# Altium project Copy of MB1019.PrjPCB (part 1 of 2)
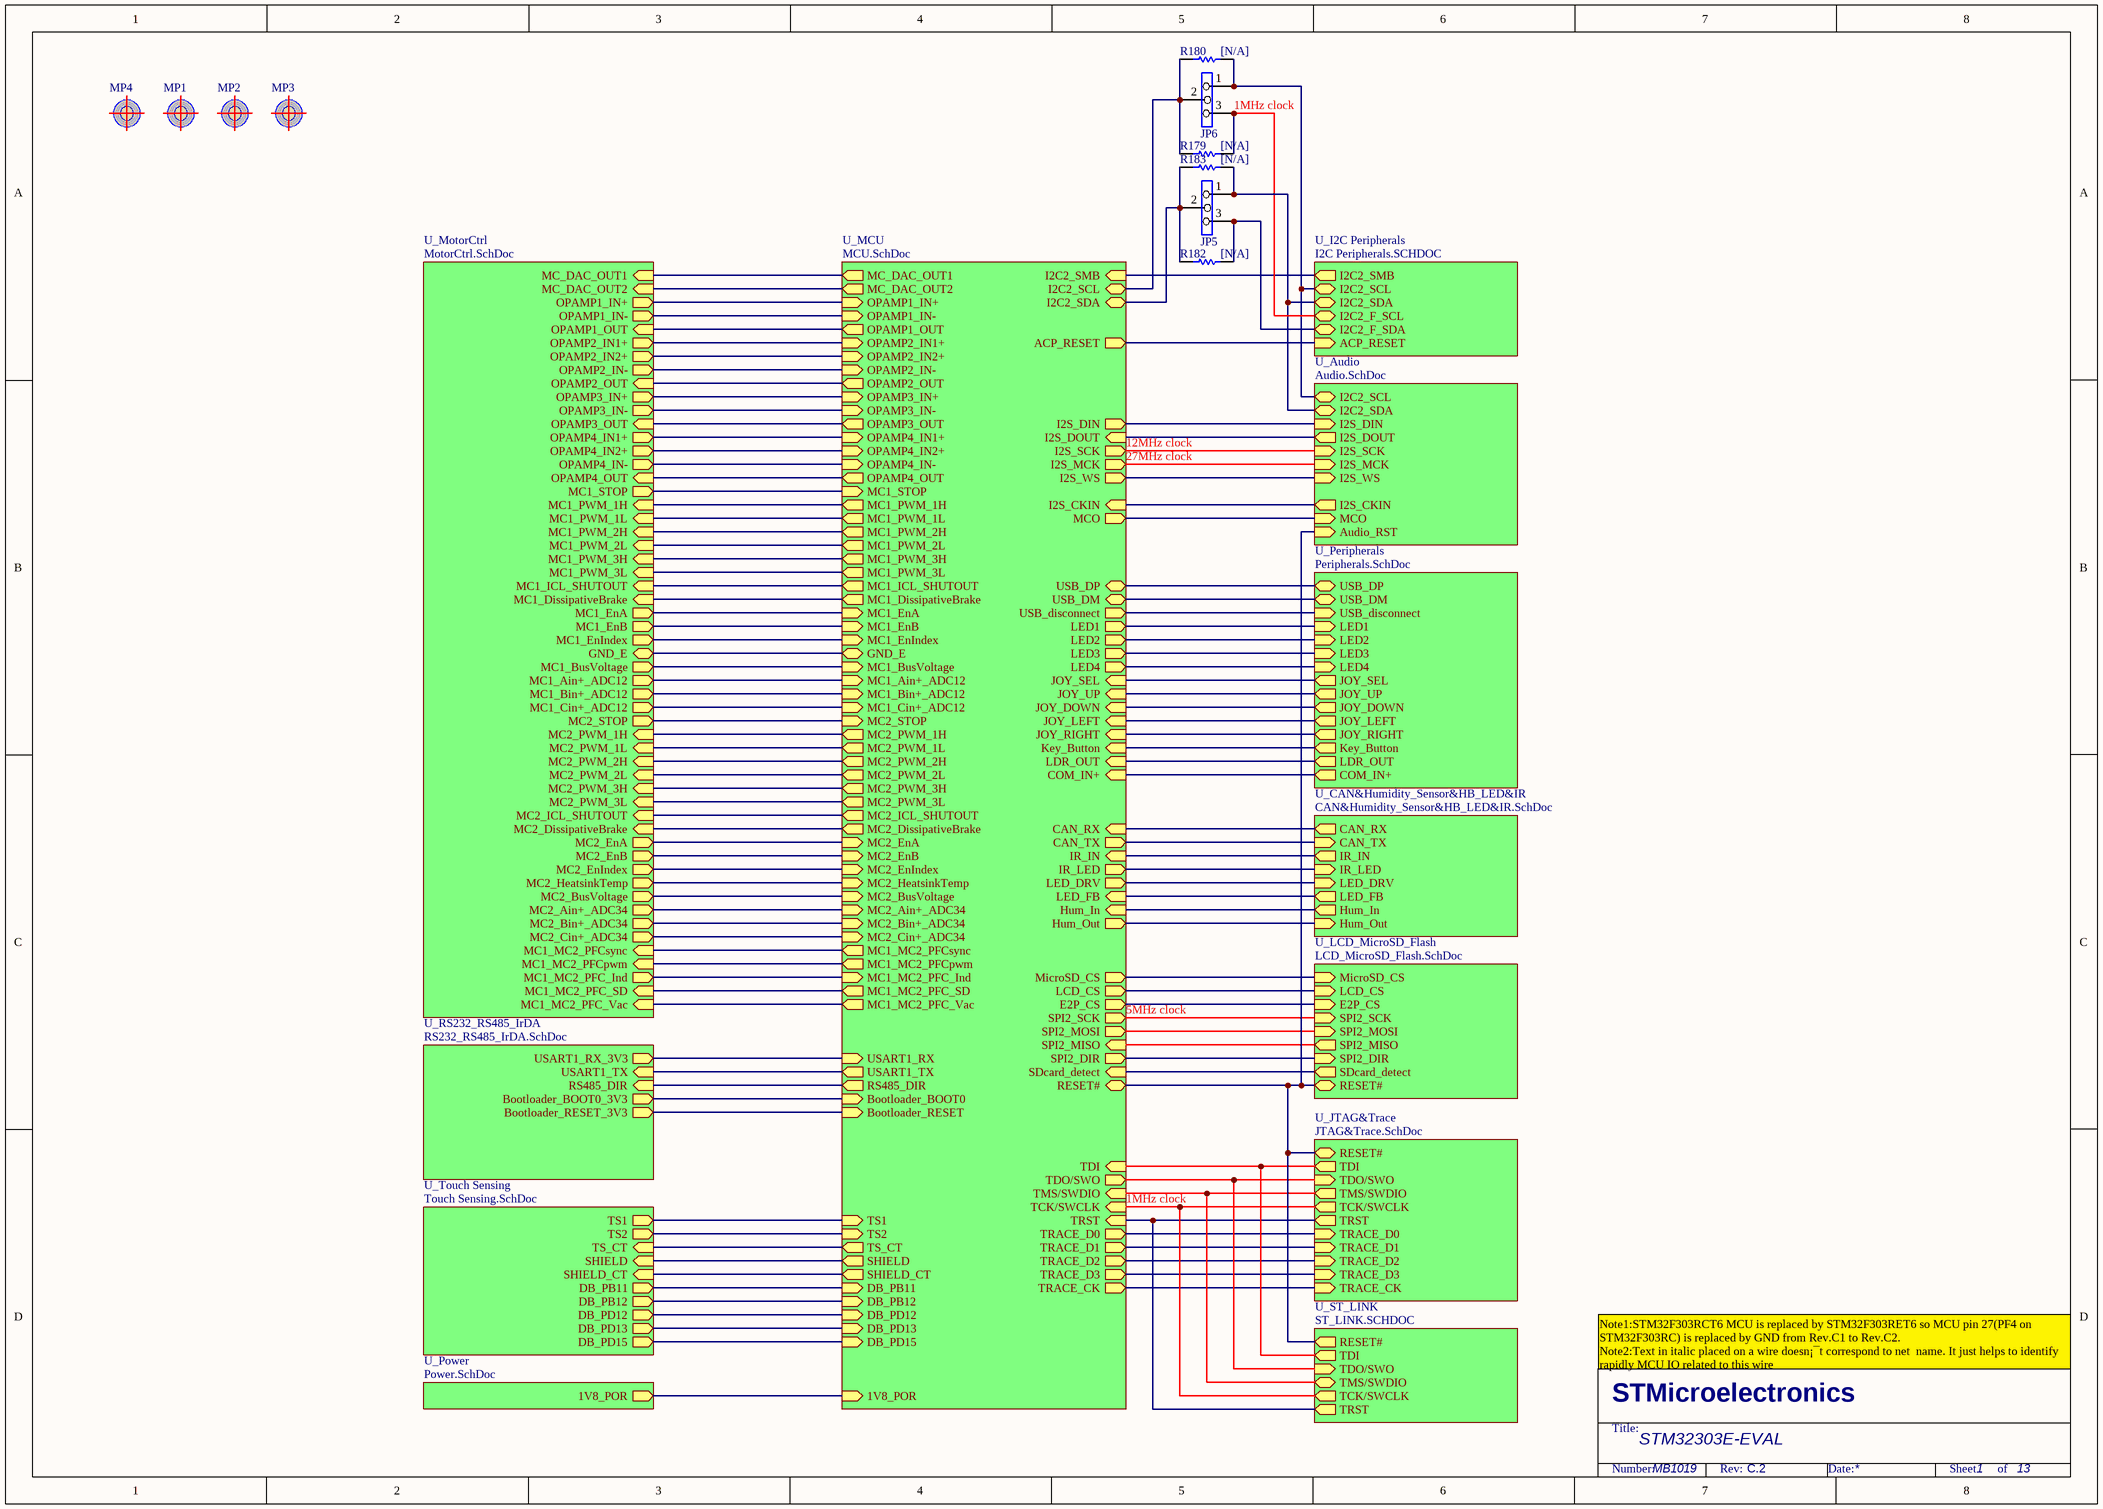
[diagram p0: MB1019.SchDoc]
13 sheets, 557 parts. Net scope: hierarchical (ports join the sheet entries above them; power ports are global).
Board file: MB1019.PcbDoc
Sheets:
  MB1019.SchDoc
    U_MCU = MCU.SchDoc
    U_MotorCtrl = MotorCtrl.SchDoc
    U_RS232_RS485_IrDA = RS232_RS485_IrDA.SchDoc
    U_Touch Sensing = Touch Sensing.SchDoc
    U_Peripherals = Peripherals.SchDoc
    U_CAN&Humidity_Sensor&HB_LED&IR = CAN&Humidity_Sensor&HB_LED&IR.SchDoc
    U_JTAG&Trace = JTAG&Trace.SchDoc
    U_ST_LINK = ST_LINK.SCHDOC
    U_Power = Power.SchDoc
    U_Audio = Audio.SchDoc
    U_I2C Peripherals = I2C Peripherals.SCHDOC
    U_LCD_MicroSD_Flash = LCD_MicroSD_Flash.SchDoc

## Sheet MB1019.SchDoc
size A3; Revision: C.2

### Parts
JP5  (no value)  [SIP3]
JP6  (no value)  [SIP3]
MP1  (no value)  [markpoint_1.0]
MP2  (no value)  [markpoint_1.0]
MP3  (no value)  [markpoint_1.0]
MP4  (no value)  [markpoint_1.0]
R179  [N/A]  [0603R]
R180  [N/A]  [0603R]
R182  [N/A]  [0603R]
R183  [N/A]  [0603R]

### Sub-sheets
U_Audio = Audio.SchDoc: I2S_WS (in), I2S_DIN (in), I2S_SCK (in), Audio_RST (in), I2S_MCK (in), MCO (in), I2S_CKIN (out), I2C2_SCL (bidir), I2C2_SDA (bidir), I2S_DOUT (out)
U_CAN&Humidity_Sensor&HB_LED&IR = CAN&Humidity_Sensor&HB_LED&IR.SchDoc: CAN_TX (in), CAN_RX (out), IR_LED (in), IR_IN (out), LED_DRV (in), LED_FB (out), Hum_Out (in), Hum_In (out)
U_I2C Peripherals = I2C Peripherals.SCHDOC: I2C2_SCL (bidir), I2C2_SDA (bidir), I2C2_SMB (out), I2C2_F_SDA (bidir), I2C2_F_SCL (bidir), ACP_RESET (in)
U_JTAG&Trace = JTAG&Trace.SchDoc: TDI (out), RESET# (bidir), TRACE_D3 (in), TRACE_D2 (in), TRACE_D1 (in), TRACE_D0 (in), TRACE_CK (in), TRST (out), TMS/SWDIO (out), TCK/SWCLK (out), TDO/SWO (in)
U_LCD_MicroSD_Flash = LCD_MicroSD_Flash.SchDoc: MicroSD_CS (in), SPI2_SCK (in), SPI2_MOSI (in), LCD_CS (in), SDcard_detect (out), RESET# (bidir), E2P_CS (in), SPI2_MISO (out), SPI2_DIR (in)
U_MCU = MCU.SchDoc: USB_DM (bidir), I2C2_SCL (bidir), I2C2_SDA (bidir), TMS/SWDIO (in), TCK/SWCLK (in), TDI (in), COM_IN+ (in), TDO/SWO (out), TRST (in), IR_IN (in), IR_LED (out), SPI2_MISO (in), SPI2_MOSI (out), RESET# (bidir), LDR_OUT (in), SPI2_SCK (out), USART1_RX (in), USART1_TX (out), LED4 (out), LED3 (out), LED1 (out), LED2 (out), Bootloader_BOOT0 (in), Bootloader_RESET (in), I2C2_SMB (in), USB_DP (bidir), CAN_RX (in), CAN_TX (out), MicroSD_CS (out), TRACE_D0 (out), TRACE_D1 (out), Key_Button (in), JOY_SEL (in), JOY_DOWN (in), JOY_LEFT (in), JOY_UP (in), JOY_RIGHT (in), TRACE_CK (out), E2P_CS (out), LCD_CS (out), TRACE_D2 (out), TRACE_D3 (out), SDcard_detect (in), DB_PD13 (in), DB_PD15 (in), 1V8_POR (in), USB_disconnect (out), MC2_HeatsinkTemp (in), OPAMP1_IN+ (in), OPAMP2_IN1+ (in), OPAMP3_IN+ (in), OPAMP3_OUT (out), OPAMP3_IN- (in), MC2_EnA (in), MC2_STOP (in), MC2_EnIndex (in), OPAMP4_IN- (in), OPAMP4_OUT (out), OPAMP4_IN1+ (in), MC1_Cin+_ADC12 (in), MC1_Ain+_ADC12 (in), MC1_Bin+_ADC12 (in), MC2_PWM_1H (out), MC2_PWM_2H (out), MC2_PWM_3H (out), MC2_PWM_1L (out), MC2_PWM_2L (out), MC2_PWM_3L (out), MC1_MC2_PFC_SD (out), MC1_EnA (in), MC1_EnB (in), MC1_EnIndex (in), MC1_MC2_PFC_Ind (in), MC2_EnB (in), MC1_MC2_PFCsync (out), MC1_MC2_PFCpwm (out), MC1_ICL_SHUTOUT (out), MC1_DissipativeBrake (out), MC1_PWM_1H (out), MC1_PWM_2H (out), MC1_PWM_3H (out), MC1_PWM_1L (out), MC1_PWM_2L (out), MC1_PWM_3L (out), LED_DRV (out), MC1_STOP (in), LED_FB (in), GND_E (bidir), MC2_ICL_SHUTOUT (out), MC2_DissipativeBrake (out), MC1_MC2_PFC_Vac (out), MC2_BusVoltage (in), MC_DAC_OUT1 (out), MC_DAC_OUT2 (out), OPAMP1_OUT (out), OPAMP1_IN- (in), OPAMP2_OUT (out), OPAMP4_IN2+ (in), OPAMP2_IN2+ (in), MC1_BusVoltage (in), RS485_DIR (out), Hum_Out (out), TS2 (in), Hum_In (in), I2S_WS (out), SHIELD (out), OPAMP2_IN- (in), MC2_Cin+_ADC34 (in), MC2_Ain+_ADC34 (in), MC2_Bin+_ADC34 (in), TS_CT (out), TS1 (in), DB_PB12 (in), SHIELD_CT (out), DB_PD12 (in), DB_PB11 (in), ACP_RESET (out), I2S_CKIN (in), MCO (out), I2S_DIN (out), I2S_SCK (out), I2S_MCK (out), I2S_DOUT (in), SPI2_DIR (out)
U_MotorCtrl = MotorCtrl.SchDoc: MC1_STOP (out), MC1_MC2_PFCsync (in), MC1_ICL_SHUTOUT (in), MC1_DissipativeBrake (in), MC1_MC2_PFCpwm (in), MC1_EnA (out), MC1_EnB (out), GND_E (bidir), MC1_BusVoltage (out), MC1_EnIndex (out), MC1_PWM_1H (in), MC1_PWM_2H (in), MC1_PWM_3H (in), MC1_PWM_1L (in), MC1_PWM_2L (in), MC1_PWM_3L (in), MC1_MC2_PFC_Ind (out), MC1_MC2_PFC_Vac (in), MC1_MC2_PFC_SD (in), MC2_STOP (out), MC2_ICL_SHUTOUT (in), MC2_DissipativeBrake (in), MC2_EnA (out), MC2_EnB (out), MC2_HeatsinkTemp (out), MC2_BusVoltage (out), MC2_EnIndex (out), MC2_PWM_1H (in), MC2_PWM_2H (in), MC2_PWM_3H (in), MC2_PWM_1L (in), MC2_PWM_2L (in), MC2_PWM_3L (in), OPAMP1_IN+ (out), OPAMP1_IN- (out), OPAMP1_OUT (in), MC1_Ain+_ADC12 (out), MC_DAC_OUT2 (in), MC_DAC_OUT1 (in), OPAMP2_IN1+ (out), OPAMP2_IN- (out), OPAMP2_OUT (in), OPAMP2_IN2+ (out), OPAMP4_IN1+ (out), OPAMP4_IN- (out), OPAMP4_OUT (in), OPAMP4_IN2+ (out), OPAMP3_IN+ (out), OPAMP3_IN- (out), OPAMP3_OUT (in), MC1_Bin+_ADC12 (out), MC1_Cin+_ADC12 (out), MC2_Cin+_ADC34 (out), MC2_Bin+_ADC34 (out), MC2_Ain+_ADC34 (out)
U_Peripherals = Peripherals.SchDoc: JOY_SEL (out), JOY_DOWN (out), JOY_LEFT (out), JOY_RIGHT (out), JOY_UP (out), USB_DM (bidir), USB_DP (bidir), Key_Button (out), USB_disconnect (in), LDR_OUT (out), COM_IN+ (out), LED4 (in), LED3 (in), LED1 (in), LED2 (in)
U_Power = Power.SchDoc: 1V8_POR (out)
U_RS232_RS485_IrDA = RS232_RS485_IrDA.SchDoc: USART1_RX_3V3 (out), RS485_DIR (in), Bootloader_BOOT0_3V3 (out), Bootloader_RESET_3V3 (out), USART1_TX (in)
U_ST_LINK = ST_LINK.SCHDOC: TDI (out), TRST (out), TMS/SWDIO (bidir), TCK/SWCLK (out), TDO/SWO (in), RESET# (out)
U_Touch Sensing = Touch Sensing.SchDoc: TS1 (out), TS2 (out), SHIELD (in), SHIELD_CT (in), TS_CT (in), DB_PD13 (out), DB_PD15 (out), DB_PD12 (out), DB_PB11 (out), DB_PB12 (out)

### Nets
GND_E: sheet U_MCU/GND_E, sheet U_MotorCtrl/GND_E
MC1_MC2_PFC_Ind: sheet U_MCU/MC1_MC2_PFC_Ind, sheet U_MotorCtrl/MC1_MC2_PFC_Ind
MC1_MC2_PFC_SD: sheet U_MCU/MC1_MC2_PFC_SD, sheet U_MotorCtrl/MC1_MC2_PFC_SD
MC1_MC2_PFC_Vac: sheet U_MCU/MC1_MC2_PFC_Vac, sheet U_MotorCtrl/MC1_MC2_PFC_Vac
MC1_MC2_PFCpwm: sheet U_MCU/MC1_MC2_PFCpwm, sheet U_MotorCtrl/MC1_MC2_PFCpwm
MC1_MC2_PFCsync: sheet U_MCU/MC1_MC2_PFCsync, sheet U_MotorCtrl/MC1_MC2_PFCsync
PA1: sheet U_MCU/OPAMP1_IN+, sheet U_MotorCtrl/OPAMP1_IN+
PA2: sheet U_MCU/OPAMP1_OUT, sheet U_MotorCtrl/OPAMP1_OUT
PA3: sheet U_MCU/OPAMP1_IN-, sheet U_MotorCtrl/OPAMP1_IN-
PA5: sheet U_MCU/MC_DAC_OUT2, sheet U_MotorCtrl/MC_DAC_OUT2
PA6: sheet U_MCU/OPAMP2_OUT, sheet U_MotorCtrl/OPAMP2_OUT
PA7: sheet U_MCU/OPAMP2_IN1+, sheet U_MotorCtrl/OPAMP2_IN1+
PA8: sheet U_MCU/MCO, sheet U_Audio/MCO
PA10: JP5.2 R182.2 R183.2 ; sheet U_MCU/I2C2_SDA
PA11: sheet U_MCU/USB_DM, sheet U_Peripherals/USB_DM
PA12: sheet U_MCU/USB_DP, sheet U_Peripherals/USB_DP
PA13: sheet U_MCU/TMS/SWDIO, sheet U_JTAG&Trace/TMS/SWDIO, sheet U_ST_LINK/TMS/SWDIO
PA14: sheet U_MCU/TCK/SWCLK, sheet U_JTAG&Trace/TCK/SWCLK, sheet U_ST_LINK/TCK/SWCLK
PA15: sheet U_MCU/TDI, sheet U_JTAG&Trace/TDI, sheet U_ST_LINK/TDI
PB1: sheet U_MCU/OPAMP3_OUT, sheet U_MotorCtrl/OPAMP3_OUT
PB2: sheet U_MCU/1V8_POR, sheet U_Power/1V8_POR
PB3: sheet U_MCU/TDO/SWO, sheet U_JTAG&Trace/TDO/SWO, sheet U_ST_LINK/TDO/SWO
PB4: sheet U_MCU/TRST, sheet U_JTAG&Trace/TRST, sheet U_ST_LINK/TRST
PB5: sheet U_MCU/JOY_LEFT, sheet U_Peripherals/JOY_LEFT
PB6: sheet U_MCU/MC2_EnA, sheet U_MotorCtrl/MC2_EnA
PB7: sheet U_MCU/MC2_STOP, sheet U_MotorCtrl/MC2_STOP
PB9: sheet U_MCU/IR_LED, sheet U_CAN&Humidity_Sensor&HB_LED&IR/IR_LED
PB10: sheet U_MCU/OPAMP4_IN-, sheet U_MotorCtrl/OPAMP4_IN-
PB13: sheet U_MCU/OPAMP4_IN2+, sheet U_MotorCtrl/OPAMP4_IN2+
PB14: sheet U_MCU/SPI2_MISO, sheet U_LCD_MicroSD_Flash/SPI2_MISO
PB15: sheet U_MCU/SPI2_MOSI, sheet U_LCD_MicroSD_Flash/SPI2_MOSI
PC0: sheet U_MCU/MC1_Cin+_ADC12, sheet U_MotorCtrl/MC1_Cin+_ADC12
PC2: sheet U_MCU/MC1_Ain+_ADC12, sheet U_MotorCtrl/MC1_Ain+_ADC12
PC3: sheet U_MCU/MC1_Bin+_ADC12, sheet U_MotorCtrl/MC1_Bin+_ADC12
PC4: sheet U_MCU/USART1_TX, sheet U_RS232_RS485_IrDA/USART1_TX
PC5: sheet U_MCU/OPAMP2_IN-, sheet U_MotorCtrl/OPAMP2_IN-
PC7: sheet U_MCU/MC2_PWM_2H, sheet U_MotorCtrl/MC2_PWM_2H
PC9: sheet U_MCU/I2S_CKIN, sheet U_Audio/I2S_CKIN
PC13: sheet U_MCU/JOY_SEL, sheet U_Peripherals/JOY_SEL
PD0: sheet U_MCU/CAN_RX, sheet U_CAN&Humidity_Sensor&HB_LED&IR/CAN_RX
PD1: sheet U_MCU/CAN_TX, sheet U_CAN&Humidity_Sensor&HB_LED&IR/CAN_TX
PD3: sheet U_MCU/MC1_EnA, sheet U_MotorCtrl/MC1_EnA
PD4: sheet U_MCU/MC1_EnB, sheet U_MotorCtrl/MC1_EnB
PD5: sheet U_MCU/JOY_DOWN, sheet U_Peripherals/JOY_DOWN
PD6: sheet U_MCU/JOY_RIGHT, sheet U_Peripherals/JOY_RIGHT
PD10: sheet U_MCU/MC2_Cin+_ADC34, sheet U_MotorCtrl/MC2_Cin+_ADC34
PD11: sheet U_MCU/MC2_Ain+_ADC34, sheet U_MotorCtrl/MC2_Ain+_ADC34
PE0: sheet U_MCU/LCD_CS, sheet U_LCD_MicroSD_Flash/LCD_CS
PE1: sheet U_MCU/USART1_RX, sheet U_RS232_RS485_IrDA/USART1_RX_3V3
PE6: sheet U_MCU/TRACE_D3, sheet U_JTAG&Trace/TRACE_D3
PE7: sheet U_MCU/JOY_UP, sheet U_Peripherals/JOY_UP
PE12: sheet U_MCU/MC1_PWM_3L, sheet U_MotorCtrl/MC1_PWM_3L
PE14: sheet U_MCU/ACP_RESET, sheet U_MCU/SPI2_DIR, sheet U_I2C Peripherals/ACP_RESET, sheet U_LCD_MicroSD_Flash/SPI2_DIR
PF6: JP6.2 R179.2 R180.2 ; sheet U_MCU/I2C2_SCL
PF9: sheet U_MCU/SPI2_SCK, sheet U_LCD_MicroSD_Flash/SPI2_SCK
PF10: sheet U_MCU/MC2_DissipativeBrake, sheet U_MotorCtrl/MC2_DissipativeBrake
RESET#: sheet U_MCU/RESET#, sheet U_JTAG&Trace/RESET#, sheet U_ST_LINK/RESET#, sheet U_Audio/Audio_RST, sheet U_LCD_MicroSD_Flash/RESET#
NetC2_2: sheet U_MCU/MC1_STOP, sheet U_MotorCtrl/MC1_STOP
NetC3_1: sheet U_MCU/MC1_BusVoltage, sheet U_MotorCtrl/MC1_BusVoltage
NetC13_2: sheet U_MCU/MC1_EnIndex, sheet U_MotorCtrl/MC1_EnIndex
NetC14_1: sheet U_MCU/MC2_BusVoltage, sheet U_MotorCtrl/MC2_BusVoltage
NetC19_2: sheet U_MCU/MC2_HeatsinkTemp, sheet U_MotorCtrl/MC2_HeatsinkTemp
NetC21_1: sheet U_MCU/OPAMP4_OUT, sheet U_MotorCtrl/OPAMP4_OUT
NetC27_2: sheet U_MCU/MC2_EnB, sheet U_MotorCtrl/MC2_EnB
NetC28_2: sheet U_MCU/MC2_EnIndex, sheet U_MotorCtrl/MC2_EnIndex
NetC29_2: sheet U_MCU/OPAMP3_IN-, sheet U_MotorCtrl/OPAMP3_IN-
NetC52_2: sheet U_MCU/TS_CT, sheet U_Touch Sensing/TS_CT
NetC68_1: sheet U_MCU/LED_FB, sheet U_CAN&Humidity_Sensor&HB_LED&IR/LED_FB
NetC133_1: sheet U_MCU/OPAMP2_IN2+, sheet U_MotorCtrl/OPAMP2_IN2+
NetC134_1: sheet U_MCU/OPAMP4_IN1+, sheet U_MotorCtrl/OPAMP4_IN1+
NetC136_1: sheet U_MCU/OPAMP3_IN+, sheet U_MotorCtrl/OPAMP3_IN+
NetCN2_3: sheet U_MCU/MC1_PWM_1H, sheet U_MotorCtrl/MC1_PWM_1H
NetCN2_5: sheet U_MCU/MC1_PWM_1L, sheet U_MotorCtrl/MC1_PWM_1L
NetCN2_7: sheet U_MCU/MC1_PWM_2H, sheet U_MotorCtrl/MC1_PWM_2H
NetCN2_9: sheet U_MCU/MC1_PWM_2L, sheet U_MotorCtrl/MC1_PWM_2L
NetCN2_11: sheet U_MCU/MC1_PWM_3H, sheet U_MotorCtrl/MC1_PWM_3H
NetCN2_21: sheet U_MCU/MC1_ICL_SHUTOUT, sheet U_MotorCtrl/MC1_ICL_SHUTOUT
NetCN2_23: sheet U_MCU/MC1_DissipativeBrake, sheet U_MotorCtrl/MC1_DissipativeBrake
NetCN4_3: sheet U_MCU/MC2_PWM_1H, sheet U_MotorCtrl/MC2_PWM_1H
NetCN4_5: sheet U_MCU/MC2_PWM_1L, sheet U_MotorCtrl/MC2_PWM_1L
NetCN4_9: sheet U_MCU/MC2_PWM_2L, sheet U_MotorCtrl/MC2_PWM_2L
NetCN4_11: sheet U_MCU/MC2_PWM_3H, sheet U_MotorCtrl/MC2_PWM_3H
NetCN4_13: sheet U_MCU/MC2_PWM_3L, sheet U_MotorCtrl/MC2_PWM_3L
NetCN4_21: sheet U_MCU/MC2_ICL_SHUTOUT, sheet U_MotorCtrl/MC2_ICL_SHUTOUT
NetCN6_51: sheet U_MCU/DB_PB11, sheet U_Touch Sensing/DB_PB11
NetCN6_52: sheet U_MCU/DB_PB12, sheet U_Touch Sensing/DB_PB12
NetCN7_2: sheet U_MCU/DB_PD15, sheet U_Touch Sensing/DB_PD15
NetCN7_4: sheet U_MCU/DB_PD13, sheet U_Touch Sensing/DB_PD13
NetCN7_6: sheet U_MCU/DB_PD12, sheet U_Touch Sensing/DB_PD12
NetCN9_12: sheet U_MCU/TRACE_CK, sheet U_JTAG&Trace/TRACE_CK
NetCN9_18: sheet U_MCU/TRACE_D2, sheet U_JTAG&Trace/TRACE_D2
NetCN16_2: sheet U_MCU/MicroSD_CS, sheet U_LCD_MicroSD_Flash/MicroSD_CS
NetCN16_10: sheet U_MCU/SDcard_detect, sheet U_LCD_MicroSD_Flash/SDcard_detect
NetD2_1: sheet U_MCU/Bootloader_BOOT0, sheet U_RS232_RS485_IrDA/Bootloader_BOOT0_3V3
NetJP1_2: sheet U_MCU/I2C2_SMB, sheet U_I2C Peripherals/I2C2_SMB
NetJP5_1: JP5.1 R183.1 ; sheet U_Audio/I2C2_SDA, sheet U_I2C Peripherals/I2C2_SDA
NetJP5_3: JP5.3 R182.1 ; sheet U_I2C Peripherals/I2C2_F_SDA
NetJP6_1: JP6.1 R180.1 ; sheet U_Audio/I2C2_SCL, sheet U_I2C Peripherals/I2C2_SCL
NetJP6_3: JP6.3 R179.1 ; sheet U_I2C Peripherals/I2C2_F_SCL
NetJP10_2: sheet U_MCU/Bootloader_RESET, sheet U_RS232_RS485_IrDA/Bootloader_RESET_3V3
NetJP18_1: sheet U_MCU/I2S_MCK, sheet U_Audio/I2S_MCK
NetJP18_3: sheet U_MCU/IR_IN, sheet U_CAN&Humidity_Sensor&HB_LED&IR/IR_IN
NetJP19_2: sheet U_MCU/Hum_In, sheet U_CAN&Humidity_Sensor&HB_LED&IR/Hum_In
NetPG3SA_2: sheet U_MCU/MC_DAC_OUT1, sheet U_MotorCtrl/MC_DAC_OUT1
NetR4_1: sheet U_MCU/TRACE_D0, sheet U_JTAG&Trace/TRACE_D0
NetR6_1: sheet U_MCU/TRACE_D1, sheet U_JTAG&Trace/TRACE_D1
NetR10_2: sheet U_MCU/LDR_OUT, sheet U_Peripherals/LDR_OUT
NetR14_1: sheet U_MCU/COM_IN+, sheet U_Peripherals/COM_IN+
NetR16_2: sheet U_MCU/I2S_WS, sheet U_Audio/I2S_WS
NetR18_2: sheet U_MCU/USB_disconnect, sheet U_Peripherals/USB_disconnect
NetR24_1: sheet U_MCU/LED1, sheet U_Peripherals/LED1
NetR26_1: sheet U_MCU/LED2, sheet U_Peripherals/LED2
NetR28_1: sheet U_MCU/LED3, sheet U_Peripherals/LED3
NetR30_1: sheet U_MCU/LED4, sheet U_Peripherals/LED4
NetR32_1: sheet U_MCU/LED_DRV, sheet U_CAN&Humidity_Sensor&HB_LED&IR/LED_DRV
NetR36_2: sheet U_MCU/SHIELD_CT, sheet U_Touch Sensing/SHIELD_CT
NetR38_2: sheet U_MCU/SHIELD, sheet U_Touch Sensing/SHIELD
NetR39_1: sheet U_MCU/MC2_Bin+_ADC34, sheet U_MotorCtrl/MC2_Bin+_ADC34
NetR42_1: sheet U_MCU/TS1, sheet U_Touch Sensing/TS1
NetR44_1: sheet U_MCU/TS2, sheet U_Touch Sensing/TS2
NetR50_1: sheet U_MCU/Hum_Out, sheet U_CAN&Humidity_Sensor&HB_LED&IR/Hum_Out
NetR52_1: sheet U_MCU/I2S_SCK, sheet U_Audio/I2S_SCK
NetR54_1: sheet U_MCU/I2S_DOUT, sheet U_Audio/I2S_DOUT
NetR56_1: sheet U_MCU/I2S_DIN, sheet U_Audio/I2S_DIN
NetR58_1: sheet U_MCU/E2P_CS, sheet U_LCD_MicroSD_Flash/E2P_CS
NetR111_1: sheet U_MCU/Key_Button, sheet U_Peripherals/Key_Button
NetR129_1: sheet U_MCU/RS485_DIR, sheet U_RS232_RS485_IrDA/RS485_DIR

### Notes on the sheet
- (near JP6) 1MHz clock
- 12MHz clock
- 27MHz clock
- 5MHz clock
- 1MHz clock
- Note1:STM32F303RCT6 MCU is replaced by STM32F303RET6 so MCU pin 27(PF4 on STM32F303RC) is replaced by GND from Rev.C1 to Rev.C2.
  Note2:Text in italic placed on a wire doesn¡¯t correspond to net  name. It just helps to identify rapidly MCU IO related to this wire
- STM32303E-EVAL
- MB1019
- 1
- 13
- STMicroelectronics
- Title:
- Number:
- Rev:
- Date:
- Sheet       of

### Library data of the parts
JP5 JP6 = Jumper3
MP1-MP4 = MARKPOINT
R179 R180 R182 R183 = Res1: Resistor; Value: 1K; Published: 8-Jun-2000; Revision: July-2002: Re-released for DXP Platform.; Publisher: Altium Limited

## Sheet MCU.SchDoc
size A4; Revision: C.2
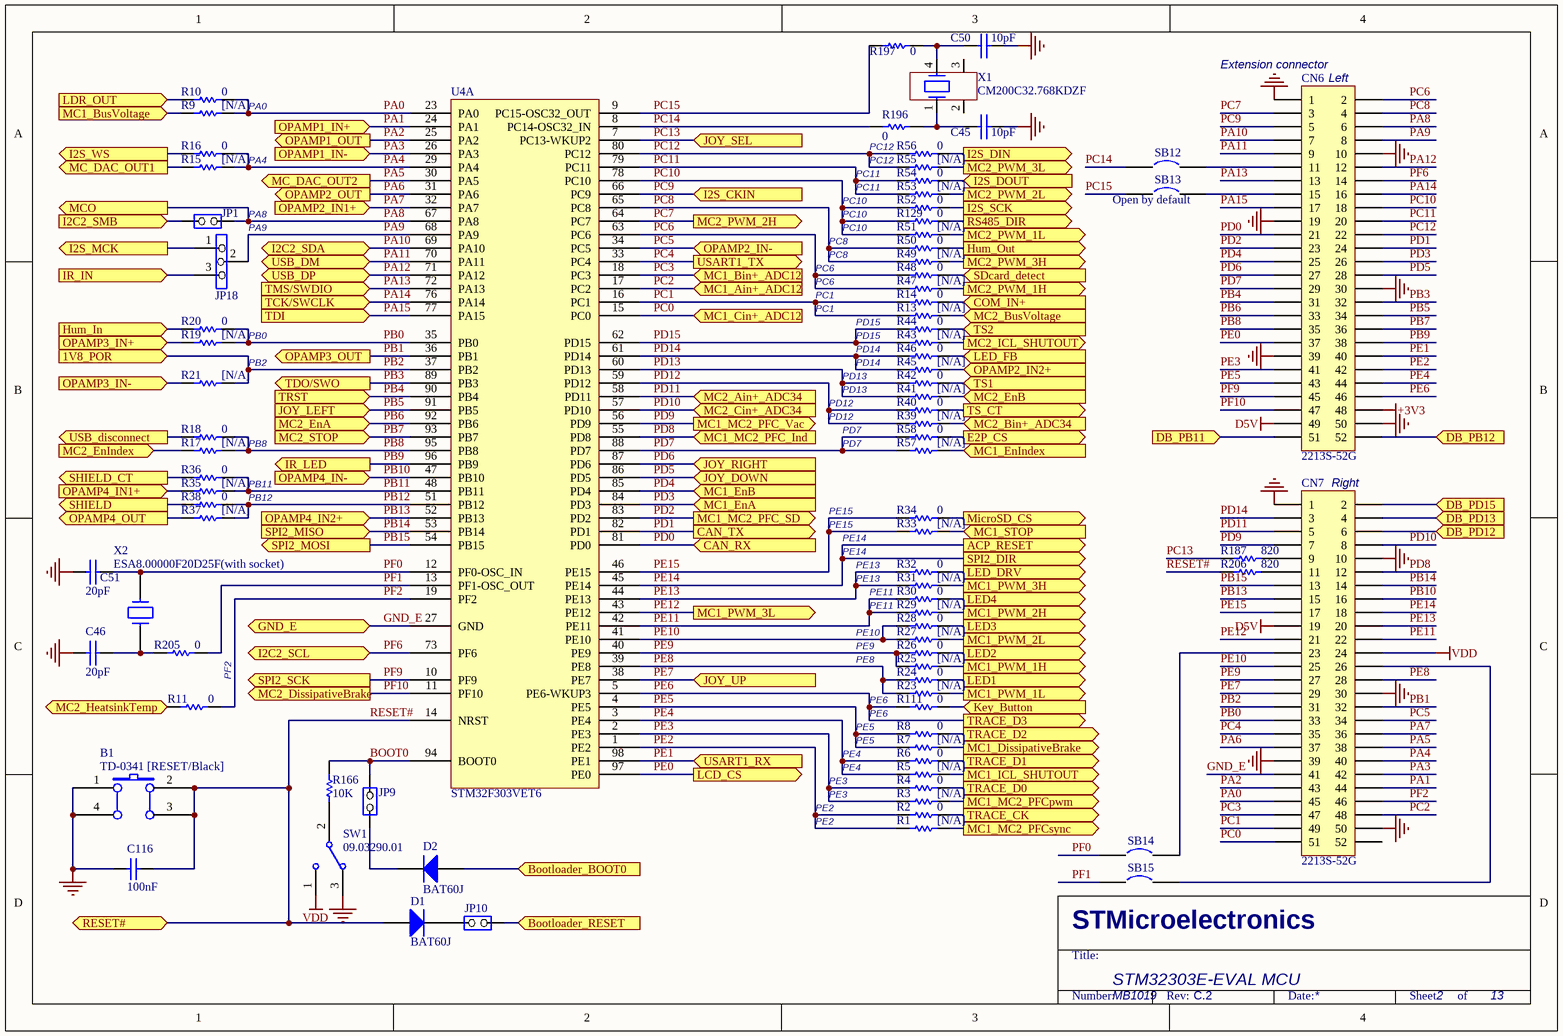
[diagram p1: MCU.SchDoc]

### Parts
B1  TD-0341 [RESET/Black]  [PB10]
C45  10pF  [0603C]
C46  20pF  [0603C]
C50  10pF  [0603C]
C51  20pF  [0603C]
C116  100nF  [0603C]
CN6  2213S-52G  [2*26P]
CN7  2213S-52G  [2*26P]
D1  BAT60J  [SOD-323]
D2  BAT60J  [SOD-323]
JP1  (no value)  [SIP2]
JP9  (no value)  [SIP2]
JP10  (no value)  [SIP2]
JP18  (no value)  [SIP3]
R1  [N/A]  [0603R]
R2  0  [0603R]
R3  [N/A]  [0603R]
R4  0  [0603R]
R5  [N/A]  [0603R]
R6  0  [0603R]
R7  [N/A]  [0603R]
R8  0  [0603R]
R9  [N/A]  [0603R]
R10  0  [0603R]
R11  0  [0603R]
R13  [N/A]  [0603R]
R14  0  [0603R]
R15  [N/A]  [0603R]
R16  0  [0603R]
R17  [N/A]  [0603R]
R18  0  [0603R]
R19  [N/A]  [0603R]
R20  0  [0603R]
R21  [N/A]  [0603R]
R23  [N/A]  [0603R]
R24  0  [0603R]
R25  [N/A]  [0603R]
R26  0  [0603R]
R27  [N/A]  [0603R]
R28  0  [0603R]
R29  [N/A]  [0603R]
R30  0  [0603R]
R31  [N/A]  [0603R]
R32  0  [0603R]
R33  [N/A]  [0603R]
R34  0  [0603R]
R35  [N/A]  [0603R]
R36  0  [0603R]
R37  [N/A]  [0603R]
R38  0  [0603R]
R39  [N/A]  [0603R]
R40  0  [0603R]
R41  [N/A]  [0603R]
R42  0  [0603R]
R43  [N/A]  [0603R]
R44  0  [0603R]
R45  [N/A]  [0603R]
R46  0  [0603R]
R47  [N/A]  [0603R]
R48  0  [0603R]
R49  [N/A]  [0603R]
R50  0  [0603R]
R51  [N/A]  [0603R]
R52  0  [0603R]
R53  [N/A]  [0603R]
R54  0  [0603R]
R55  [N/A]  [0603R]
R56  0  [0603R]
R57  [N/A]  [0603R]
R58  0  [0603R]
R111  0  [0603R]
R129  0  [0603R]
R166  10K  [0603R]
R187  820  [0603R]
R196  0  [0603R]
R197  0  [0603R]
R205  0  [0603R]
R206  820  [0603R]
SB12  (no value)  [JP2_SMD]
SB13  (no value)  [JP2_SMD]
SB14  (no value)  [JP2_SMD]
SB15  (no value)  [JP2_SMD]
SW1  09.03290.01  [SIP3]
U4  STM32F303VET6  [IC149-100-025-B5]  (part A of 2)
X1  CM200C32.768KDZF  [SM8]
X2  ESA8.00000F20D25F(with socket)  [XTAL_socket]

### Ports
1V8_POR (in), ACP_RESET (out), Bootloader_BOOT0 (in), Bootloader_RESET (in), CAN_RX (in), CAN_TX (out), COM_IN+ (in), DB_PB11 (in), DB_PB12 (in), DB_PD12 (in), DB_PD13 (in), DB_PD15 (in), E2P_CS (out), GND_E (bidir), Hum_In (in), Hum_Out (out), I2C2_SCL (bidir), I2C2_SDA (bidir), I2C2_SMB (in), I2S_CKIN (in), I2S_DIN (out), I2S_DOUT (in), I2S_MCK (out), I2S_SCK (out), I2S_WS (out), IR_IN (in), IR_LED (out), JOY_DOWN (in), JOY_LEFT (in), JOY_RIGHT (in), JOY_SEL (in), JOY_UP (in), Key_Button (in), LCD_CS (out), LDR_OUT (in), LED1 (out), LED2 (out), LED3 (out), LED4 (out), LED_DRV (out), LED_FB (in), MC1_Ain+_ADC12 (in), MC1_Bin+_ADC12 (in), MC1_BusVoltage (in), MC1_Cin+_ADC12 (in), MC1_DissipativeBrake (out), MC1_EnA (in), MC1_EnB (in), MC1_EnIndex (in), MC1_ICL_SHUTOUT (out), MC1_MC2_PFC_Ind (in), MC1_MC2_PFC_SD (out), MC1_MC2_PFC_Vac (out), MC1_MC2_PFCpwm (out), MC1_MC2_PFCsync (out), MC1_PWM_1H (out), MC1_PWM_1L (out), MC1_PWM_2H (out), MC1_PWM_2L (out), MC1_PWM_3H (out), MC1_PWM_3L (out), MC1_STOP (in), MC2_Ain+_ADC34 (in), MC2_Bin+_ADC34 (in), MC2_BusVoltage (in), MC2_Cin+_ADC34 (in), MC2_DissipativeBrake (out), MC2_EnA (in), MC2_EnB (in), MC2_EnIndex (in), MC2_HeatsinkTemp (in), MC2_ICL_SHUTOUT (out), MC2_PWM_1H (out), MC2_PWM_1L (out), MC2_PWM_2H (out), MC2_PWM_2L (out), MC2_PWM_3H (out), MC2_PWM_3L (out), MC2_STOP (in), MC_DAC_OUT1 (out), MC_DAC_OUT2 (out), MCO (out), MicroSD_CS (out), OPAMP1_IN+ (in), OPAMP1_IN- (in), OPAMP1_OUT (out), OPAMP2_IN1+ (in), OPAMP2_IN2+ (in), OPAMP2_IN- (in), OPAMP2_OUT (out), OPAMP3_IN+ (in), OPAMP3_IN- (in), OPAMP3_OUT (out), OPAMP4_IN1+ (in), OPAMP4_IN2+ (in), OPAMP4_IN- (in), OPAMP4_OUT (out), RESET# (bidir), RS485_DIR (out), SDcard_detect (in), SHIELD (out), SHIELD_CT (out), SPI2_DIR (out), SPI2_MISO (in), SPI2_MOSI (out), SPI2_SCK (out), TCK/SWCLK (in), TDI (in), TDO/SWO (out), TMS/SWDIO (in), TRACE_CK (out), TRACE_D0 (out), TRACE_D1 (out), TRACE_D2 (out), TRACE_D3 (out), TRST (in), TS1 (in), TS2 (in), TS_CT (out), USART1_RX (in), USART1_TX (out), USB_disconnect (out), USB_DM (bidir), USB_DP (bidir)

### Nets
+3V3: CN6.48
D5V: CN6.49 CN7.19
GND: B1.1(A0) B1.4(A1) C45.2 C46.2 C50.2 C51.2 C116.1 CN6.1 CN6.10 CN6.19 CN6.30 CN6.39 CN6.50 CN7.1 CN7.10 CN7.30 CN7.39 CN7.50 SW1.3
VDD: CN7.24 SW1.1
BOOT0: JP9.2(NO) R166.1 U4.94(BOOT0)
GND_E: CN7.41 U4.27(GND) ; port GND_E
MC1_MC2_PFCpwm: R3.1 ; port MC1_MC2_PFCpwm
MC1_MC2_PFCsync: R1.1 ; port MC1_MC2_PFCsync
PA0: CN7.45 R9.1 R10.1 U4.23(PA0)
PA1: CN7.44 U4.24(PA1) ; port OPAMP1_IN+
PA2: CN7.43 U4.25(PA2) ; port OPAMP1_OUT
PA3: CN7.42 U4.26(PA3) ; port OPAMP1_IN-
PA4: CN7.40 R15.1 R16.1 U4.29(PA4)
PA5: CN7.38 U4.30(PA5) ; port MC_DAC_OUT2
PA6: CN7.37 U4.31(PA6) ; port OPAMP2_OUT
PA7: CN7.36 U4.32(PA7) ; port OPAMP2_IN1+
PA8: CN6.6 JP1.1(COMMON) U4.67(PA8) ; port MCO
PA9: CN6.8 JP18.2 U4.68(PA9)
PA10: CN6.7 U4.69(PA10) ; port I2C2_SDA
PA11: CN6.9 U4.70(PA11) ; port USB_DM
PA12: CN6.12 U4.71(PA12) ; port USB_DP
PA13: CN6.13 U4.72(PA13) ; port TMS/SWDIO
PA14: CN6.16 U4.76(PA14) ; port TCK/SWCLK
PA15: CN6.17 U4.77(PA15) ; port TDI
PB0: CN7.33 R19.1 R20.1 U4.35(PB0)
PB1: CN7.32 U4.36(PB1) ; port OPAMP3_OUT
PB2: CN7.31 R21.1 U4.37(PB2) ; port 1V8_POR
PB3: CN6.32 U4.89(PB3) ; port TDO/SWO
PB4: CN6.31 U4.90(PB4) ; port TRST
PB5: CN6.34 U4.91(PB5) ; port JOY_LEFT
PB6: CN6.33 U4.92(PB6) ; port MC2_EnA
PB7: CN6.36 U4.93(PB7) ; port MC2_STOP
PB8: CN6.35 R17.1 R18.1 U4.95(PB8)
PB9: CN6.38 U4.96(PB9) ; port IR_LED
PB10: CN7.16 U4.47(PB10) ; port OPAMP4_IN-
PB11: R35.1 R36.1 U4.48(PB11)
PB12: R37.1 R38.1 U4.51(PB12)
PB13: CN7.15 U4.52(PB13) ; port OPAMP4_IN2+
PB14: CN7.14 U4.53(PB14) ; port SPI2_MISO
PB15: CN7.13 U4.54(PB15) ; port SPI2_MOSI
PC0: CN7.51 U4.15(PC0) ; port MC1_Cin+_ADC12
PC1: CN7.49 R13.2 R14.2 U4.16(PC1)
PC2: CN7.48 U4.17(PC2) ; port MC1_Ain+_ADC12
PC3: CN7.47 U4.18(PC3) ; port MC1_Bin+_ADC12
PC4: CN7.35 U4.33(PC4) ; port USART1_TX
PC5: CN7.34 U4.34(PC5) ; port OPAMP2_IN-
PC6: CN6.2 R47.2 R48.2 U4.63(PC6)
PC7: CN6.3 U4.64(PC7) ; port MC2_PWM_2H
PC8: CN6.4 R49.2 R50.2 U4.65(PC8)
PC9: CN6.5 U4.66(PC9) ; port I2S_CKIN
PC10: CN6.18 R51.2 R52.2 R129.2 U4.78(PC10)
PC11: CN6.20 R53.2 R54.2 U4.79(PC11)
PC12: CN6.22 R55.2 R56.2 U4.80(PC12)
PC13: R187.1 U4.7(PC13-WKUP2) ; port JOY_SEL
PC14: R196.2 SB12.1 U4.8(PC14-OSC32_IN)
PC15: R197.2 SB13.1 U4.9(PC15-OSC32_OUT)
PD0: CN6.21 U4.81(PD0) ; port CAN_RX
PD1: CN6.24 U4.82(PD1) ; port CAN_TX
PD2: CN6.23 U4.83(PD2) ; port MC1_MC2_PFC_SD  [project net MC1_MC2_PFC_SD]
PD3: CN6.26 U4.84(PD3) ; port MC1_EnA
PD4: CN6.25 U4.85(PD4) ; port MC1_EnB
PD5: CN6.28 U4.86(PD5) ; port JOY_DOWN
PD6: CN6.27 U4.87(PD6) ; port JOY_RIGHT
PD7: CN6.29 R57.2 R58.2 U4.88(PD7)
PD8: CN7.12 U4.55(PD8) ; port MC1_MC2_PFC_Ind  [project net MC1_MC2_PFC_Ind]
PD9: CN7.7 U4.56(PD9) ; port MC1_MC2_PFC_Vac  [project net MC1_MC2_PFC_Vac]
PD10: CN7.8 U4.57(PD10) ; port MC2_Cin+_ADC34
PD11: CN7.5 U4.58(PD11) ; port MC2_Ain+_ADC34
PD12: R39.2 R40.2 U4.59(PD12)
PD13: R41.2 R42.2 U4.60(PD13)
PD14: CN7.3 R45.2 R46.2 U4.61(PD14)
PD15: R43.2 R44.2 U4.62(PD15)
PE0: CN6.37 U4.97(PE0) ; port LCD_CS
PE1: CN6.40 U4.98(PE1) ; port USART1_RX
PE2: CN6.42 R1.2 R2.2 U4.1(PE2)
PE3: CN6.41 R3.2 R4.2 U4.2(PE3)
PE4: CN6.44 R5.2 R6.2 U4.3(PE4)
PE5: CN6.43 R7.2 R8.2 U4.4(PE5)
PE6: CN6.46 R111.2 U4.5(PE6-WKUP3) ; port TRACE_D3
PE7: CN7.29 U4.38(PE7) ; port JOY_UP
PE8: CN7.28 R23.2 R24.2 U4.39(PE8)
PE9: CN7.27 R25.2 R26.2 U4.40(PE9)
PE10: CN7.25 R27.2 R28.2 U4.41(PE10)
PE11: CN7.22 R29.2 R30.2 U4.42(PE11)
PE12: CN7.21 U4.43(PE12) ; port MC1_PWM_3L
PE13: CN7.20 R31.2 R32.2 U4.44(PE13)
PE14: CN7.18 U4.45(PE14) ; port ACP_RESET, port SPI2_DIR
PE15: CN7.17 R33.2 R34.2 U4.46(PE15)
PF0: C51.1 SB14.1 U4.12(PF0-OSC_IN) X2.2
PF1: R205.1 SB15.1 U4.13(PF1-OSC_OUT)
PF2: CN7.46 R11.1 U4.19(PF2)
PF6: CN6.14 U4.73(PF6) ; port I2C2_SCL
PF9: CN6.45 U4.10(PF9) ; port SPI2_SCK
PF10: CN6.47 U4.11(PF10) ; port MC2_DissipativeBrake
RESET#: B1.2(B0) B1.3(B1) C116.2 D1.1(A) R206.2 U4.14(NRST) ; port RESET#
NetC2_2: R33.1 ; port MC1_STOP
NetC3_1: R9.2 ; port MC1_BusVoltage
NetC13_2: R57.1 ; port MC1_EnIndex
NetC14_1: R13.1 ; port MC2_BusVoltage
NetC19_2: R11.2 ; port MC2_HeatsinkTemp
NetC21_1: R37.2 ; port OPAMP4_OUT
NetC27_2: R41.1 ; port MC2_EnB
NetC28_2: R17.2 ; port MC2_EnIndex
NetC29_2: R21.2 ; port OPAMP3_IN-
NetC45_1: C45.1 R196.1 X1.1
NetC46_1: C46.1 R205.2 X2.1
NetC50_1: C50.1 R197.1 X1.4
NetC52_2: R40.1 ; port TS_CT
NetC68_1: R46.1 ; port LED_FB
NetC133_1: R45.1 ; port OPAMP2_IN2+
NetC134_1: R35.2 ; port OPAMP4_IN1+
NetC136_1: R19.2 ; port OPAMP3_IN+
NetCN2_3: R25.1 ; port MC1_PWM_1H
NetCN2_5: R23.1 ; port MC1_PWM_1L
NetCN2_7: R29.1 ; port MC1_PWM_2H
NetCN2_9: R27.1 ; port MC1_PWM_2L
NetCN2_11: R31.1 ; port MC1_PWM_3H
NetCN2_21: R5.1 ; port MC1_ICL_SHUTOUT
NetCN2_23: R7.1 ; port MC1_DissipativeBrake
NetCN4_3: R47.1 ; port MC2_PWM_1H
NetCN4_5: R51.1 ; port MC2_PWM_1L
NetCN4_9: R53.1 ; port MC2_PWM_2L
NetCN4_11: R49.1 ; port MC2_PWM_3H
NetCN4_13: R55.1 ; port MC2_PWM_3L
NetCN4_21: R43.1 ; port MC2_ICL_SHUTOUT
NetCN6_11: CN6.11 SB12.2
NetCN6_15: CN6.15 SB13.2
NetCN6_51: CN6.51 ; port DB_PB11
NetCN6_52: CN6.52 ; port DB_PB12
NetCN7_2: CN7.2 ; port DB_PD15
NetCN7_4: CN7.4 ; port DB_PD13
NetCN7_6: CN7.6 ; port DB_PD12
NetCN7_9: CN7.9 R187.2
NetCN7_11: CN7.11 R206.1
NetCN7_23: CN7.23 SB14.2
NetCN7_26: CN7.26 SB15.2
NetCN9_12: R2.1 ; port TRACE_CK
NetCN9_18: R8.1 ; port TRACE_D2
NetCN16_2: R34.1 ; port MicroSD_CS
NetCN16_10: R48.1 ; port SDcard_detect
NetD1_2: D1.2(K) JP10.1(COMMON)
NetD2_1: D2.1(A) ; port Bootloader_BOOT0
NetD2_2: D2.2(K) JP9.1(COMMON)
NetJP1_2: JP1.2(NO) ; port I2C2_SMB
NetJP10_2: JP10.2(NO) ; port Bootloader_RESET
NetJP18_1: JP18.1 ; port I2S_MCK
NetJP18_3: JP18.3 ; port IR_IN
NetJP19_2: R20.2 ; port Hum_In
NetPG3SA_2: R15.2 ; port MC_DAC_OUT1
NetR4_1: R4.1 ; port TRACE_D0
NetR6_1: R6.1 ; port TRACE_D1
NetR10_2: R10.2 ; port LDR_OUT
NetR14_1: R14.1 ; port COM_IN+
NetR16_2: R16.2 ; port I2S_WS
NetR18_2: R18.2 ; port USB_disconnect
NetR24_1: R24.1 ; port LED1
NetR26_1: R26.1 ; port LED2
NetR28_1: R28.1 ; port LED3
NetR30_1: R30.1 ; port LED4
NetR32_1: R32.1 ; port LED_DRV
NetR36_2: R36.2 ; port SHIELD_CT
NetR38_2: R38.2 ; port SHIELD
NetR39_1: R39.1 ; port MC2_Bin+_ADC34
NetR42_1: R42.1 ; port TS1
NetR44_1: R44.1 ; port TS2
NetR50_1: R50.1 ; port Hum_Out
NetR52_1: R52.1 ; port I2S_SCK
NetR54_1: R54.1 ; port I2S_DOUT
NetR56_1: R56.1 ; port I2S_DIN
NetR58_1: R58.1 ; port E2P_CS
NetR111_1: R111.1 ; port Key_Button
NetR129_1: R129.1 ; port RS485_DIR
NetR166_2: R166.2 SW1.2

Not connected (* = marked no-connect by the designer): CN7 52; X1 2 3

### Notes on the sheet
- PA0
- (near CN6) Extension connector
- (near CN6) Left
- PA4
- PC11
- PC12
- PA8
- PA9
- PC8
- PC10
- (near SB13) Open by default
- PC1
- PC6
- PB0
- PB2
- PD13
- PD14
- PD15
- PB8
- PD12
- PD7
- PB11
- PB12
- PE15
- (near CN7) Right
- PE14
- PE13
- PE9
- PE10
- PE11
- PF2
- PE8
- PE6
- PE3
- PE4
- PE5
- PE2
- STM32303E-EVAL MCU
- MB1019
- 2
- 13
- STMicroelectronics
- Title:
- Number:
- Rev:
- Date:
- Sheet       of

### Library data of the parts
B1 = SW PUSHBUTTON: SE PUSHBUTTON
C45 C46 C50 C51 = CAP: Capacitor
C116 = CAP: Capacitor; Value: 100pF; Published: 8-Jun-2000; Revision: July-2002: Re-released for DXP Platform.; Publisher: Altium Limited
CN6 CN7 = Header 26X2_1: Header, 26-Pin, Dual row; Revision: 17-Jul-2002: Re-released for DXP Platform.; Publisher: Altium Limited
D1 D2 = Diode: Default Diode; Code - JEDEC: DO-214-AB; Published: 8-Jun-2000; Revision: July-2002: Re-released for DXP Platform.; Publisher: Altium Limited
JP1 JP9 JP10 = JP2
JP18 = Jumper3
R1-R11 R13-R21 R23-R58 R111 R129 R187 R196 R197 R205 R206 = Res1: Resistor; Value: 1K; Published: 8-Jun-2000; Revision: July-2002: Re-released for DXP Platform.; Publisher: Altium Limited
R166 = res1: Resistor; Value: 1K; Published: 8-Jun-2000; Revision: July-2002: Re-released for DXP Platform.; Publisher: Altium Limited
SB12-SB15 = Circuit Breaker: Published: 24-Mar-1999; Revision: July-2002: Re-released for DXP Platform.; Publisher: Altium Limited
SW1 = SW-SPDT: SPDT Subminiature Toggle Switch, Right Angle Mounting, Vertical Actuation; Revision 1: Jul-2002: Re-released for DXP Platform.; Revision 2: 17-Dec-2003: Schematic revised, PCB Footprint replaced.; Published: 24-Mar-1999; Datasheet: Latest Revision: 05-Dec-2000; Publisher: Altium Limited
U4 = STM32F303VCT6
X1 = MC306
X2 = CRYSTAL

## Sheet MotorCtrl.SchDoc
size A3; Revision: C.2
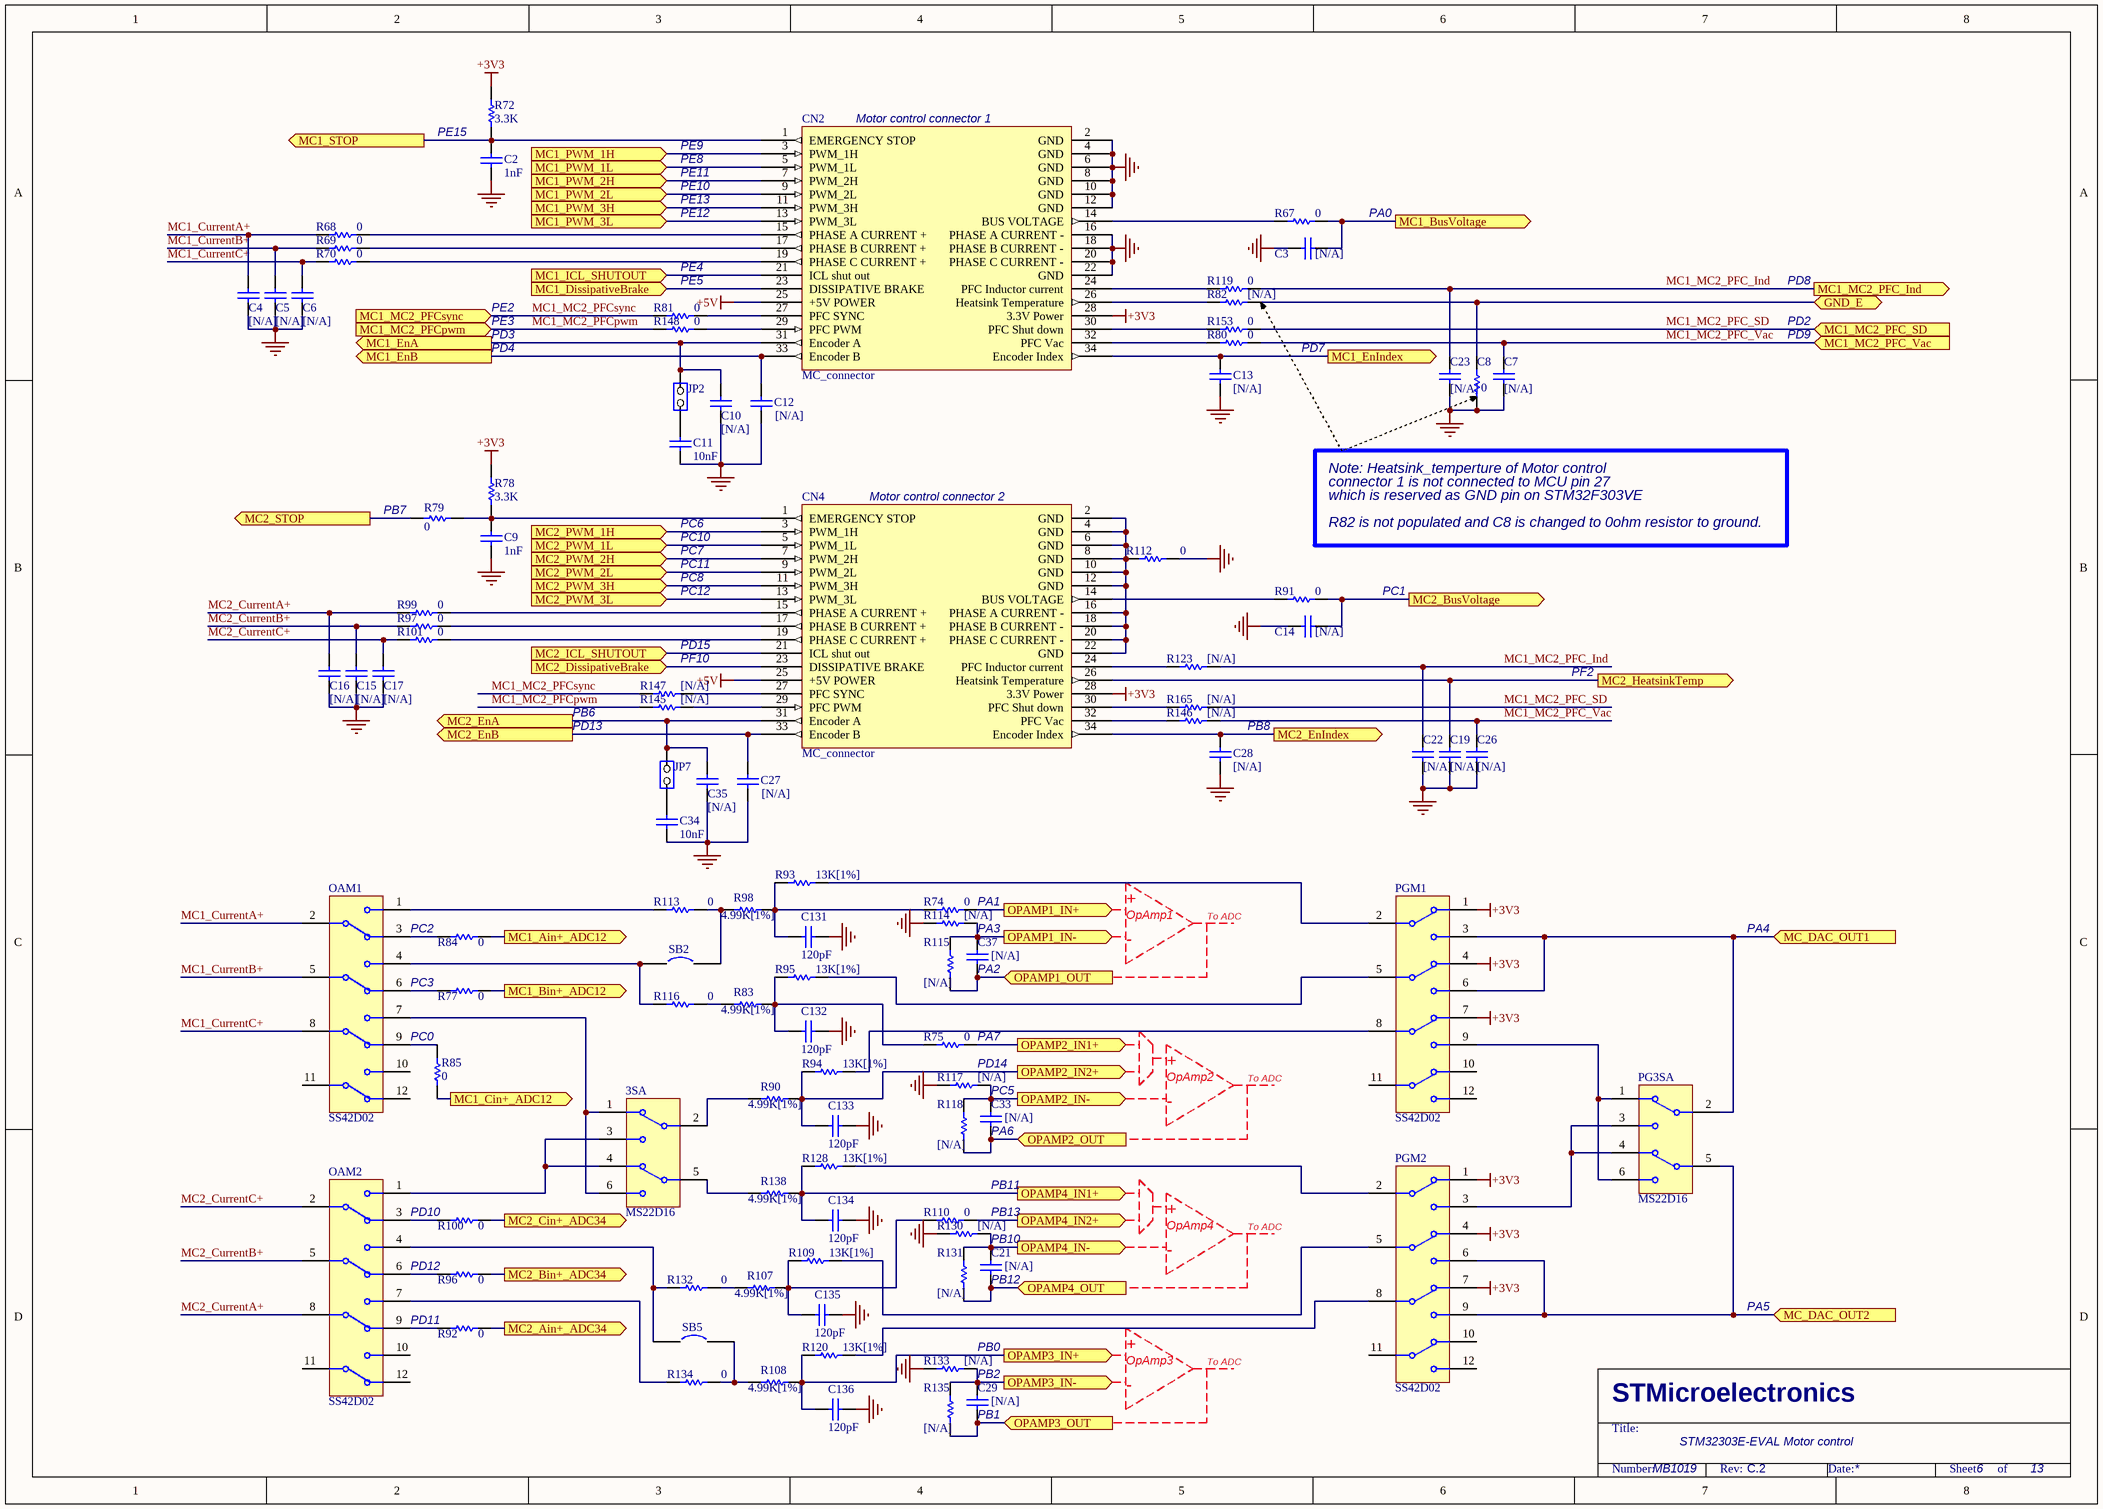
[diagram p2: MotorCtrl.SchDoc]

### Parts
3SA  MS22D16  [MS22D16]
C2  1nF  [0603C]
C3  [N/A]  [0603C]
C4  [N/A]  [0603C]
C5  [N/A]  [0603C]
C6  [N/A]  [0603C]
C7  [N/A]  [0603C]
C8  0  [0603R]
C9  1nF  [0603C]
C10  [N/A]  [0603C]
C11  10nF  [0603C]
C12  [N/A]  [0603C]
C13  [N/A]  [0603C]
C14  [N/A]  [0603C]
C15  [N/A]  [0603C]
C16  [N/A]  [0603C]
C17  [N/A]  [0603C]
C19  [N/A]  [0603C]
C21  [N/A]  [0603C]
C22  [N/A]  [0603C]
C23  [N/A]  [0603C]
C26  [N/A]  [0603C]
C27  [N/A]  [0603C]
C28  [N/A]  [0603C]
C29  [N/A]  [0603C]
C33  [N/A]  [0603C]
C34  10nF  [0603C]
C35  [N/A]  [0603C]
C37  [N/A]  [0603C]
C131  120pF  [0603C]
C132  120pF  [0603C]
C133  120pF  [0603C]
C134  120pF  [0603C]
C135  120pF  [0603C]
C136  120pF  [0603C]
CN2  MC_connector  [IDC34S]
CN4  MC_connector  [IDC34S]
JP2  (no value)  [SIP2]
JP7  (no value)  [SIP2]
OAM1  SS42D02  [SS42D02]
OAM2  SS42D02  [SS42D02]
PG3SA  MS22D16  [MS22D16]
PGM1  SS42D02  [SS42D02]
PGM2  SS42D02  [SS42D02]
R67  0  [0603R]
R68  0  [0603R]
R69  0  [0603R]
R70  0  [0603R]
R72  3.3K  [0603R]
R74  0  [0603R]
R75  0  [0603R]
R77  0  [0603R]
R78  3.3K  [0603R]
R79  0  [0603R]
R80  0  [0603R]
R81  0  [0603R]
R82  [N/A]  [0603R]
R83  4.99K[1%]  [0603R]
R84  0  [0603R]
R85  0  [0603R]
R90  4.99K[1%]  [0603R]
R91  0  [0603R]
R92  0  [0603R]
R93  13K[1%]  [0603R]
R94  13K[1%]  [0603R]
R95  13K[1%]  [0603R]
R96  0  [0603R]
R97  0  [0603R]
R98  4.99K[1%]  [0603R]
R99  0  [0603R]
R100  0  [0603R]
R101  0  [0603R]
R107  4.99K[1%]  [0603R]
R108  4.99K[1%]  [0603R]
R109  13K[1%]  [0603R]
R110  0  [0603R]
R112  0  [0603R]
R113  0  [0603R]
R114  [N/A]  [0603R]
R115  [N/A]  [0603R]
R116  0  [0603R]
R117  [N/A]  [0603R]
R118  [N/A]  [0603R]
R119  0  [0603R]
R120  13K[1%]  [0603R]
R123  [N/A]  [0603R]
R128  13K[1%]  [0603R]
R130  [N/A]  [0603R]
R131  [N/A]  [0603R]
R132  0  [0603R]
R133  [N/A]  [0603R]
R134  0  [0603R]
R135  [N/A]  [0603R]
R138  4.99K[1%]  [0603R]
R145  [N/A]  [0603R]
R146  [N/A]  [0603R]
R147  [N/A]  [0603R]
R148  0  [0603R]
R153  0  [0603R]
R165  [N/A]  [0603R]
SB2  (no value)  [JP2_SMD]
SB5  (no value)  [JP2_SMD]

### Ports
GND_E (bidir), MC1_Ain+_ADC12 (out), MC1_Bin+_ADC12 (out), MC1_BusVoltage (out), MC1_Cin+_ADC12 (out), MC1_DissipativeBrake (in), MC1_EnA (out), MC1_EnB (out), MC1_EnIndex (out), MC1_ICL_SHUTOUT (in), MC1_MC2_PFC_Ind (out), MC1_MC2_PFC_SD (in), MC1_MC2_PFC_Vac (in), MC1_MC2_PFCpwm (in), MC1_MC2_PFCsync (in), MC1_PWM_1H (in), MC1_PWM_1L (in), MC1_PWM_2H (in), MC1_PWM_2L (in), MC1_PWM_3H (in), MC1_PWM_3L (in), MC1_STOP (out), MC2_Ain+_ADC34 (out), MC2_Bin+_ADC34 (out), MC2_BusVoltage (out), MC2_Cin+_ADC34 (out), MC2_DissipativeBrake (in), MC2_EnA (out), MC2_EnB (out), MC2_EnIndex (out), MC2_HeatsinkTemp (out), MC2_ICL_SHUTOUT (in), MC2_PWM_1H (in), MC2_PWM_1L (in), MC2_PWM_2H (in), MC2_PWM_2L (in), MC2_PWM_3H (in), MC2_PWM_3L (in), MC2_STOP (out), MC_DAC_OUT1 (in), MC_DAC_OUT2 (in), OPAMP1_IN+ (out), OPAMP1_IN- (out), OPAMP1_OUT (in), OPAMP2_IN1+ (out), OPAMP2_IN2+ (out), OPAMP2_IN- (out), OPAMP2_OUT (in), OPAMP3_IN+ (out), OPAMP3_IN- (out), OPAMP3_OUT (in), OPAMP4_IN1+ (out), OPAMP4_IN2+ (out), OPAMP4_IN- (out), OPAMP4_OUT (in)

### Nets
+3V3: CN2.28(3.3V_Power) CN4.28(3.3V_Power) PGM1.1 PGM1.4 PGM1.7 PGM2.1 PGM2.4 PGM2.7 R72.2 R78.2
+5V: CN2.25(+5V_POWER) CN4.25(+5V_POWER)
GND: C2.1 C3.2 C4.1 C5.1 C6.1 C7.1 C8.2 C9.1 C10.1 C11.1 C12.1 C13.1 C14.2 C15.1 C16.1 C17.1 C19.1 C22.1 C23.1 C26.1 C27.1 C28.1 C34.1 C35.1 C131.2 C132.2 C133.2 C134.2 C135.2 C136.2 CN2.2(GND) CN2.4(GND) CN2.6(GND) CN2.8(GND) CN2.10(GND) CN2.12(GND) CN2.16(PHASE_A_CURRENT_-) CN2.18(PHASE_B_CURRENT_-) CN2.20(PHASE_C_CURRENT_-) CN2.22(GND) R112.1 R114.1 R117.1 R130.1 R133.1
GND_E: C8.1 R82.2 ; port GND_E
MC1_CurrentA+: C4.2 OAM1.2 R68.2
MC1_CurrentB+: C5.2 OAM1.5 R69.2
MC1_CurrentC+: C6.2 OAM1.8 R70.2
MC1_MC2_PFC_Ind: C22.2 C23.2 R119.1 R123.1 ; port MC1_MC2_PFC_Ind
MC1_MC2_PFC_SD: R153.1 R165.1 ; port MC1_MC2_PFC_SD
MC1_MC2_PFC_Vac: C7.2 C26.2 R80.1 R146.1 ; port MC1_MC2_PFC_Vac
MC1_MC2_PFCpwm: R145.2 R148.2 ; port MC1_MC2_PFCpwm
MC1_MC2_PFCsync: R81.2 R147.2 ; port MC1_MC2_PFCsync
MC2_CurrentA+: C16.2 OAM2.8 R99.2
MC2_CurrentB+: C15.2 OAM2.5 R97.2
MC2_CurrentC+: C17.2 OAM2.2 R101.2
PA1: R74.1 ; port OPAMP1_IN+
PA2: C37.1 R115.1 ; port OPAMP1_OUT
PA3: C37.2 R114.2 R115.2 ; port OPAMP1_IN-
PA5: PG3SA.5 PGM2.6 PGM2.9 ; port MC_DAC_OUT2
PA6: C33.1 R118.1 ; port OPAMP2_OUT
PA7: R75.1 ; port OPAMP2_IN1+
PB1: C29.1 R135.1 ; port OPAMP3_OUT
PB6: C35.2 CN4.31(Encoder_A) JP7.1(COMMON) ; port MC2_EnA
PB7: R79.2 ; port MC2_STOP
PB10: C21.2 R130.2 R131.2 ; port OPAMP4_IN-
PB13: R110.1 ; port OPAMP4_IN2+
PC0: R85.2 ; port MC1_Cin+_ADC12
PC2: R84.1 ; port MC1_Ain+_ADC12
PC3: R77.1 ; port MC1_Bin+_ADC12
PC5: C33.2 R117.2 R118.2 ; port OPAMP2_IN-
PC7: CN4.7(PWM_2H) ; port MC2_PWM_2H
PD3: C10.2 CN2.31(Encoder_A) JP2.1(COMMON) ; port MC1_EnA
PD4: C12.2 CN2.33(Encoder_B) ; port MC1_EnB
PD10: R100.1 ; port MC2_Cin+_ADC34
PD11: R92.1 ; port MC2_Ain+_ADC34
PE12: CN2.13(PWM_3L) ; port MC1_PWM_3L
PF10: CN4.23(DISSIPATIVE_BRAKE) ; port MC2_DissipativeBrake
Net3SA_1: 3SA.1 3SA.6 OAM1.7
Net3SA_2: 3SA.2 R90.1
Net3SA_3: 3SA.3 3SA.4 OAM2.1
Net3SA_5: 3SA.5 R138.1
NetC2_2: C2.2 CN2.1(EMERGENCY_STOP) R72.1 ; port MC1_STOP
NetC3_1: C3.1 R67.1 ; port MC1_BusVoltage
NetC9_2: C9.2 CN4.1(EMERGENCY_STOP) R78.1 R79.1
NetC11_2: C11.2 JP2.2(NO)
NetC13_2: C13.2 CN2.34(Encoder_Index) ; port MC1_EnIndex
NetC14_1: C14.1 R91.1 ; port MC2_BusVoltage
NetC19_2: C19.2 CN4.26(Heatsink_Temperature) ; port MC2_HeatsinkTemp
NetC21_1: C21.1 R131.1 ; port OPAMP4_OUT
NetC27_2: C27.2 CN4.33(Encoder_B) ; port MC2_EnB
NetC28_2: C28.2 CN4.34(Encoder_Index) ; port MC2_EnIndex
NetC29_2: C29.2 R133.2 R135.2 ; port OPAMP3_IN-
NetC34_2: C34.2 JP7.2(NO)
NetC131_1: C131.1 R74.2 R93.1 R98.2
NetC132_1: C132.1 R75.2 R83.2 R95.1
NetC133_1: C133.1 R90.2 R94.1 ; port OPAMP2_IN2+
NetC134_1: C134.1 R128.1 R138.2 ; port OPAMP4_IN1+
NetC135_1: C135.1 R107.2 R109.1 R110.2
NetC136_1: C136.1 R108.2 R120.1 ; port OPAMP3_IN+
NetCN2_3: CN2.3(PWM_1H) ; port MC1_PWM_1H
NetCN2_5: CN2.5(PWM_1L) ; port MC1_PWM_1L
NetCN2_7: CN2.7(PWM_2H) ; port MC1_PWM_2H
NetCN2_9: CN2.9(PWM_2L) ; port MC1_PWM_2L
NetCN2_11: CN2.11(PWM_3H) ; port MC1_PWM_3H
NetCN2_14: CN2.14(BUS_VOLTAGE) R67.2
NetCN2_15: CN2.15(PHASE_A_CURRENT_+) R68.1
NetCN2_17: CN2.17(PHASE_B_CURRENT_+) R69.1
NetCN2_19: CN2.19(PHASE_C_CURRENT_+) R70.1
NetCN2_21: CN2.21(ICL_shut_out) ; port MC1_ICL_SHUTOUT
NetCN2_23: CN2.23(DISSIPATIVE_BRAKE) ; port MC1_DissipativeBrake
NetCN2_24: CN2.24(PFC_Inductor_current) R119.2
NetCN2_26: CN2.26(Heatsink_Temperature) R82.1
NetCN2_27: CN2.27(PFC_SYNC) R81.1
NetCN2_29: CN2.29(PFC_PWM) R148.1
NetCN2_30: CN2.30(PFC_Shut_down) R153.2
NetCN2_32: CN2.32(PFC_Vac) R80.2
NetCN4_2: CN4.2(GND) CN4.4(GND) CN4.6(GND) CN4.8(GND) CN4.10(GND) CN4.12(GND) CN4.16(PHASE_A_CURRENT_-) CN4.18(PHASE_B_CURRENT_-) CN4.20(PHASE_C_CURRENT_-) CN4.22(GND) R112.2
NetCN4_3: CN4.3(PWM_1H) ; port MC2_PWM_1H
NetCN4_5: CN4.5(PWM_1L) ; port MC2_PWM_1L
NetCN4_9: CN4.9(PWM_2L) ; port MC2_PWM_2L
NetCN4_11: CN4.11(PWM_3H) ; port MC2_PWM_3H
NetCN4_13: CN4.13(PWM_3L) ; port MC2_PWM_3L
NetCN4_14: CN4.14(BUS_VOLTAGE) R91.2
NetCN4_15: CN4.15(PHASE_A_CURRENT_+) R99.1
NetCN4_17: CN4.17(PHASE_B_CURRENT_+) R97.1
NetCN4_19: CN4.19(PHASE_C_CURRENT_+) R101.1
NetCN4_21: CN4.21(ICL_shut_out) ; port MC2_ICL_SHUTOUT
NetCN4_24: CN4.24(PFC_Inductor_current) R123.2
NetCN4_27: CN4.27(PFC_SYNC) R147.1
NetCN4_29: CN4.29(PFC_PWM) R145.1
NetCN4_30: CN4.30(PFC_Shut_down) R165.2
NetCN4_32: CN4.32(PFC_Vac) R146.2
NetOAM1_1: OAM1.1 R113.2
NetOAM1_3: OAM1.3 R84.2
NetOAM1_4: OAM1.4 R116.2 SB2.1
NetOAM1_6: OAM1.6 R77.2
NetOAM1_9: OAM1.9 R85.1
NetOAM2_3: OAM2.3 R100.2
NetOAM2_4: OAM2.4 R132.2 SB5.1
NetOAM2_6: OAM2.6 R96.2
NetOAM2_7: OAM2.7 R134.2
NetOAM2_9: OAM2.9 R92.2
NetPG3SA_1: PG3SA.1 PG3SA.6 PGM1.9
NetPG3SA_2: PG3SA.2 PGM1.3 PGM1.6 ; port MC_DAC_OUT1
NetPG3SA_3: PG3SA.3 PG3SA.4 PGM2.3
NetPGM1_2: PGM1.2 R93.2
NetPGM1_5: PGM1.5 R95.2
NetPGM1_8: PGM1.8 R94.2
NetPGM2_2: PGM2.2 R128.2
NetPGM2_5: PGM2.5 R109.2
NetPGM2_8: PGM2.8 R120.2
NetR39_1: R96.1 ; port MC2_Bin+_ADC34
NetR83_1: R83.1 R116.1
NetR98_1: R98.1 R113.1 SB2.2
NetR107_1: R107.1 R132.1
NetR108_1: R108.1 R134.1 SB5.2

Not connected (* = marked no-connect by the designer): OAM1 10 11 12; OAM2 10 11 12; PGM1 10 11 12; PGM2 10 11 12

### Notes on the sheet
- PE15
- PE9
- PE8
- PE11
- (near CN2) Motor control connector 1
- PE10
- PE13
- PE12
- PA0
- PE2
- PE5
- PE4
- PD8
- PD3
- PD4
- PE3
- PD7
- PD2
- PD9
- (near R79) PB7
- (near CN4) Motor control connector 2
- Note: Heatsink_temperture of Motor control
- which is reserved as GND pin on STM32F303VE
- connector 1 is not connected to MCU pin 27
- PC6
- PC10
- PC7
- PC11
- PC8
- R82 is not populated and C8 is changed to 0ohm resistor to ground.
- PC12
- PD15
- PC1
- PB6
- PF10
- PF2
- PD13
- PB8
- PA1
- +
- OpAmp1
- To ADC
- PC2
- PC3
- PA3
- (near C37) PA2
- -
- PA4
- PC0
- (near R75) PA7
- PD14
- PC5
- OpAmp2
- (near C33) PA6
- PB11
- PD10
- PB13
- PB10
- OpAmp4
- PD12
- PD11
- (near C21) PB12
- PA5
- (near R133) PB0
- PB2
- OpAmp3
- (near C29) PB1
- STM32303E-EVAL Motor control
- MB1019
- 6
- 13
- STMicroelectronics
- Title:
- Number:
- Rev:
- Date:
- Sheet       of

### Library data of the parts
3SA PG3SA = MS22D16: DPDT; Revision 1: Jul-2002: Re-released for DXP Platform.; Revision 2: 17-Dec-2003: Schematic revised, PCB Footprint replaced.; Published: 24-Mar-1999; Datasheet: Latest Revision: 05-Dec-2000; Publisher: Altium Limited
C2 C9 = CAP: Capacitor; Value: 100pF; Published: 8-Jun-2000; Revision: July-2002: Re-released for DXP Platform.; Publisher: Altium Limited
C3-C7 C10-C17 C19 C21-C23 C26-C29 C33-C35 C37 C131-C136 = cap: Capacitor; Value: 100pF; Published: 8-Jun-2000; Revision: July-2002: Re-released for DXP Platform.; Publisher: Altium Limited
C8 R67-R70 R72 R74 R75 R77-R85 R90-R101 R107-R110 R112-R120 R123 R128 R130-R135 R138 R145-R148 R153 R165 = Res1: Resistor; Value: 1K; Published: 8-Jun-2000; Revision: July-2002: Re-released for DXP Platform.; Publisher: Altium Limited
CN2 CN4 = MC_connector_1
JP2 JP7 = JP2
OAM1 OAM2 = SS42D02_1: SPDT Subminiature Toggle Switch, Right Angle Mounting, Vertical Actuation; Revision 1: Jul-2002: Re-released for DXP Platform.; Revision 2: 17-Dec-2003: Schematic revised, PCB Footprint replaced.; Published: 24-Mar-1999; Datasheet: Latest Revision: 05-Dec-2000; Publisher: Altium Limited
PGM1 PGM2 = SS42D02: SPDT Subminiature Toggle Switch, Right Angle Mounting, Vertical Actuation; Revision 1: Jul-2002: Re-released for DXP Platform.; Revision 2: 17-Dec-2003: Schematic revised, PCB Footprint replaced.; Published: 24-Mar-1999; Datasheet: Latest Revision: 05-Dec-2000; Publisher: Altium Limited
SB2 SB5 = Circuit Breaker: Published: 24-Mar-1999; Revision: July-2002: Re-released for DXP Platform.; Publisher: Altium Limited

## Sheet RS232_RS485_IrDA.SchDoc
size A4; Revision: C.2
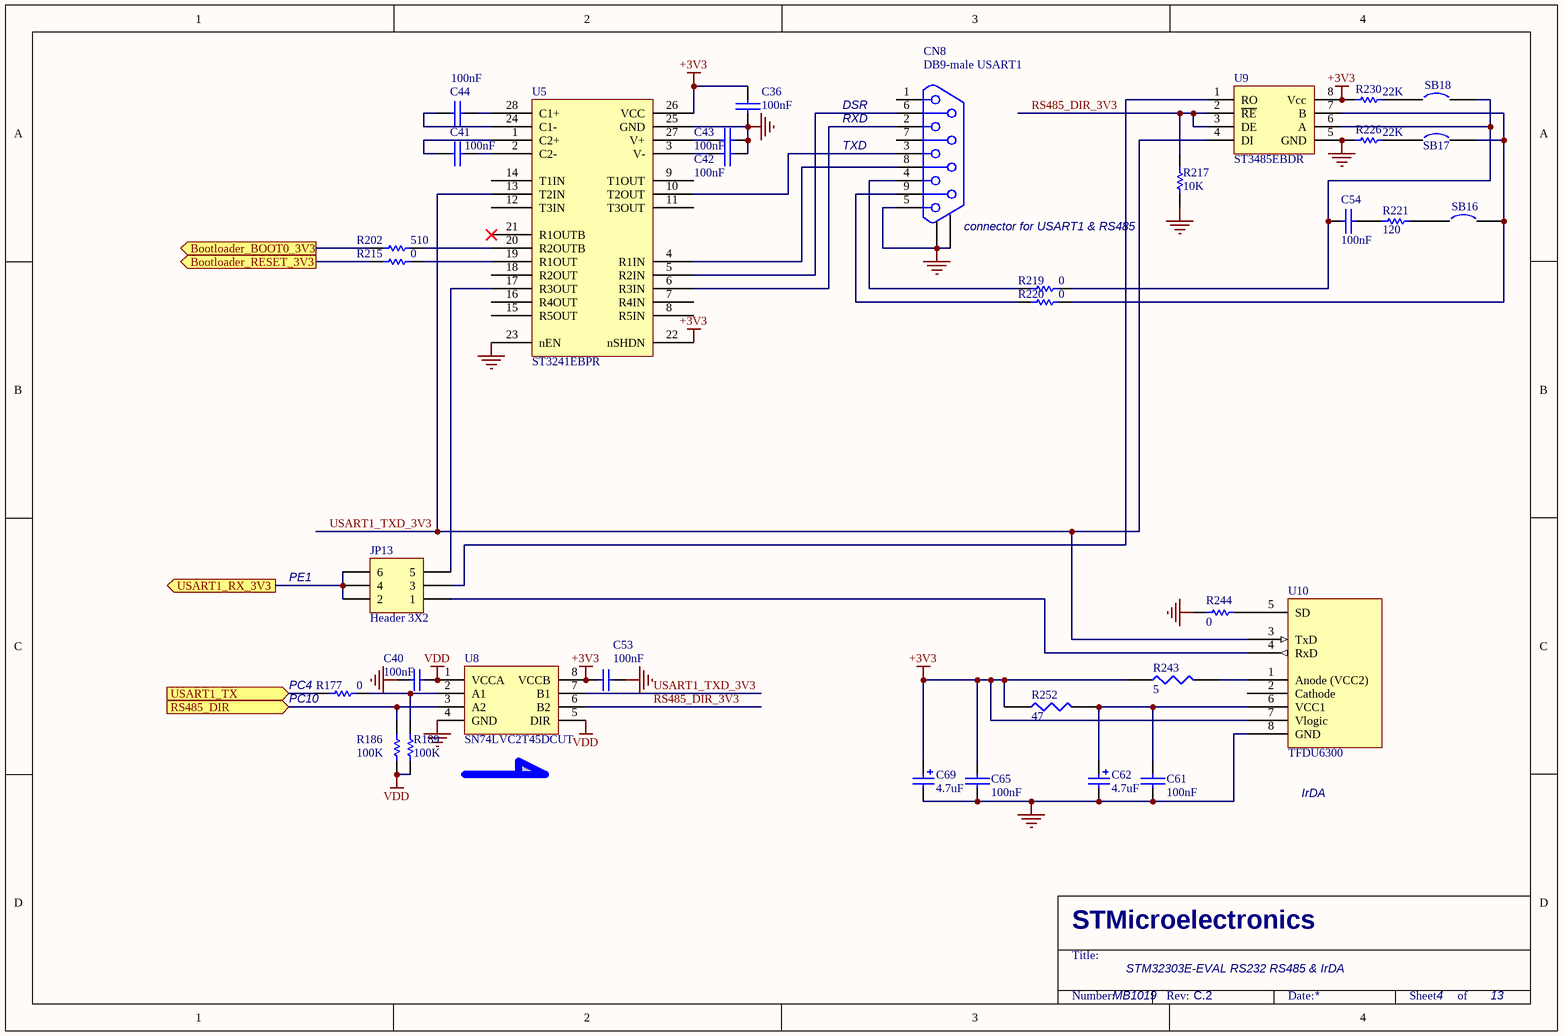
[diagram p3: RS232_RS485_IrDA.SchDoc]

### Parts
C36  100nF  [0603C]
C40  100nF  [0603C]
C41  100nF  [0603C]
C42  100nF  [0603C]
C43  100nF  [0603C]
C44  100nF  [0603C]
C53  100nF  [0603C]
C54  100nF  [0603C]
C61  100nF  [0603C]
C62  4.7uF  [TAN-A]
C65  100nF  [0603C]
C69  4.7uF  [TAN-A]
CN8  DB9-male USART1  [DB9/M]
JP13  Header 3X2  [2*3P]
R177  0  [0603R]
R186  100K  [0603R]
R189  100K  [0603R]
R202  510  [0603R]
R215  0  [0603R]
R217  10K  [0603R]
R219  0  [0603R]
R220  0  [0603R]
R221  120  [0603R]
R226  22K  [0603R]
R230  22K  [0603R]
R243  5  [0603R]
R244  0  [0603R]
R252  47  [0603R]
SB16  (no value)  [JP2_SMD]
SB17  (no value)  [JP2_SMD]
SB18  (no value)  [JP2_SMD]
U5  ST3241EBPR  [SSOP28]
U8  SN74LVC2T45DCUT  [VSSOP8]
U9  ST3485EBDR  [SO8]
U10  TFDU6300  [IR_VISHAY3]

### Ports
Bootloader_BOOT0_3V3 (out), Bootloader_RESET_3V3 (out), RS485_DIR (in), USART1_RX_3V3 (out), USART1_TX (in)

### Nets
+3V3: C36.2 C53.2 C65.1 C69.1 R230.2 R243.1 R252.1 U5.22(nSHDN) U5.26(VCC) U8.8(VCCB) U9.8(Vcc) U10.7(Vlogic)
GND: C36.1 C40.1 C42.2 C43.2 C53.1 C61.2 C62.2 C65.2 C69.2 CN8.0 CN8.5 R217.1 R226.2 R244.2 U5.23(nEN) U5.25(GND) U8.4(GND) U9.5(GND) U10.8(GND)
VDD: C40.2 R186.2 R189.2 U8.1(VCCA) U8.5(DIR)
PC4: R177.2 ; port USART1_TX
PE1: JP13.2 JP13.4 JP13.6 ; port USART1_RX_3V3
RS485_DIR_3V3: R217.2 U8.6(B2) U9.2(~{RE}) U9.3(DE)
USART1_TXD_3V3: U5.13(T2IN) U8.7(B1) U9.4(DI) U10.3(TxD)
NetC41_1: C41.1 U5.1(C2+)
NetC41_2: C41.2 U5.2(C2-)
NetC42_1: C42.1 U5.3(V-)
NetC43_1: C43.1 U5.27(V+)
NetC44_1: C44.1 U5.24(C1-)
NetC44_2: C44.2 U5.28(C1+)
NetC54_1: C54.1 R221.1
NetC54_2: C54.2 R219.1 SB18.2 U9.6(A)
NetC61_1: C61.1 C62.1 R252.2 U10.6(VCC1)
NetCN8_2: CN8.2 U5.6(R3IN)
NetCN8_3: CN8.3 U5.10(T2OUT)
NetCN8_4: CN8.4 R219.2
NetCN8_6: CN8.6 U5.5(R2IN)
NetCN8_8: CN8.8 U5.4(R1IN)
NetCN8_9: CN8.9 R220.2
NetD2_1: R202.1 ; port Bootloader_BOOT0_3V3
NetJP10_2: R215.1 ; port Bootloader_RESET_3V3
NetJP13_1: JP13.1 U10.4(RxD)
NetJP13_3: JP13.3 U9.1(RO)
NetJP13_5: JP13.5 U5.17(R3OUT)
NetR129_1: R186.1 U8.3(A2) ; port RS485_DIR
NetR177_1: R177.1 R189.1 U8.2(A1)
NetR202_2: R202.2 U5.20(R2OUTB)
NetR215_2: R215.2 U5.19(R1OUT)
NetR220_1: R220.1 SB16.2 SB17.2 U9.7(B)
NetR221_2: R221.2 SB16.1
NetR226_1: R226.1 SB17.1
NetR230_1: R230.1 SB18.1
NetR243_2: R243.2 U10.1(Anode_(VCC2))
NetR244_1: R244.1 U10.5(SD)

Not connected (* = marked no-connect by the designer): CN8 1 7; U5 7(R4IN) 8(R5IN) 9(T1OUT) 11(T3OUT) 12(T3IN) 14(T1IN) 15(R5OUT) 16(R4OUT) 18(R2OUT) 21(R1OUTB)*; U10 2(Cathode)

### Notes on the sheet
- DSR
- RXD
- TXD
- (near CN8) connector for USART1 & RS485
- PE1
- (near R177) PC4
- (near R177) PC10
- IrDA
- STM32303E-EVAL RS232 RS485 & IrDA
- MB1019
- 4
- 13
- STMicroelectronics
- Title:
- Number:
- Rev:
- Date:
- Sheet       of

### Library data of the parts
C36 C41-C44 C54 C61 C65 = CAP: Capacitor
C40 C53 = CAP: Capacitor; Value: 100pF; Published: 8-Jun-2000; Revision: July-2002: Re-released for DXP Platform.; Publisher: Altium Limited
C62 C69 = Cap Pol1: Polarized Capacitor (Radial); Value: 100pF; Published: 8-Jun-2000; Revision: July-2002: Re-released for DXP Platform.; Publisher: Altium Limited
CN8 = DB9
JP13 = Header 3X2: Header, 3-Pin, Dual row; Revision: 17-Jul-2002: Re-released for DXP Platform.; Publisher: Altium Limited
R177 = res1: Resistor; Value: 1K; Published: 8-Jun-2000; Revision: July-2002: Re-released for DXP Platform.; Publisher: Altium Limited
R186 R189 R202 R215 R217 R219-R221 R226 R230 R244 = Res1: Resistor; Value: 1K; Published: 8-Jun-2000; Revision: July-2002: Re-released for DXP Platform.; Publisher: Altium Limited
R243 R252 = RES1
SB16-SB18 = Circuit Breaker: Published: 24-Mar-1999; Revision: July-2002: Re-released for DXP Platform.; Publisher: Altium Limited
U5 = ST3241
U9 = ST485ABDR
U10 = TFDU4300

## Sheet Touch Sensing.SchDoc
size A4; Revision: C.2
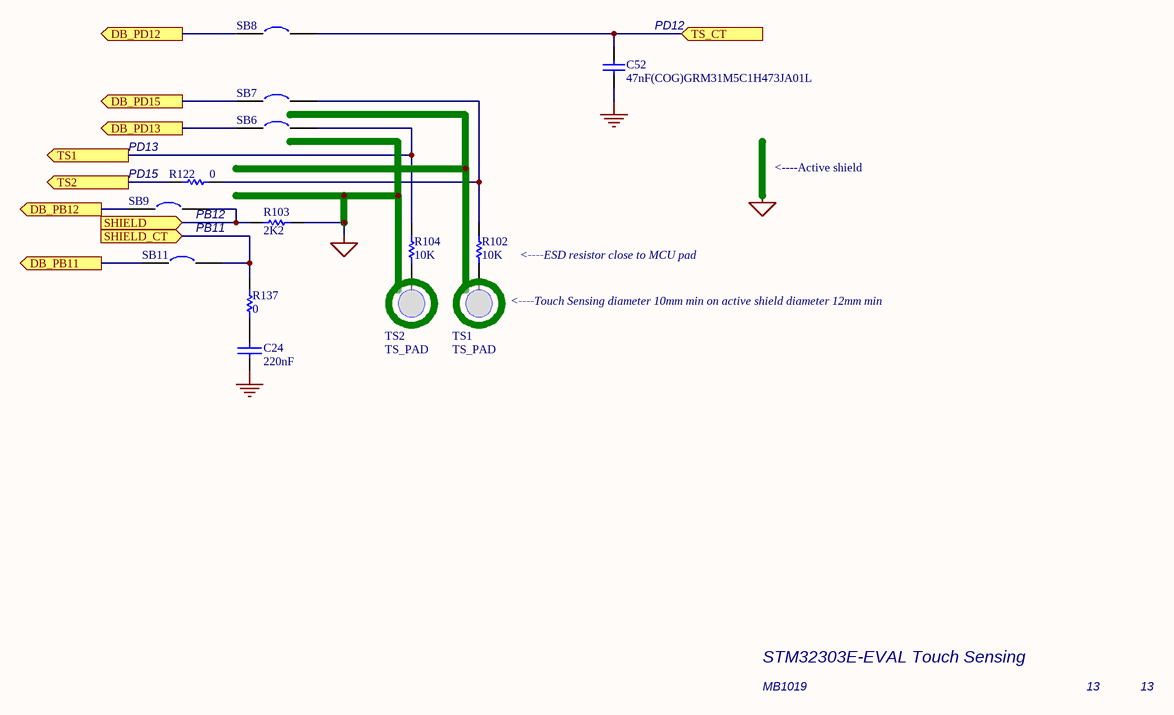
[diagram p4: Touch Sensing.SchDoc]

### Parts
C24  220nF  [0603C]
C52  47nF(COG)GRM31M5C1H473JA01L  [1206C]
R102  10K  [0603R]
R103  2K2  [0603R]
R104  10K  [0603R]
R122  0  [0603R]
R137  0  [0603R]
SB6  (no value)  [JP2_SMD]
SB7  (no value)  [JP2_SMD]
SB8  (no value)  [JP2_SMD]
SB9  (no value)  [JP2_SMD]
SB11  (no value)  [JP2_SMD]
TS1  TS_PAD  [TS_PAD]
TS2  TS_PAD  [TS_PAD]

### Ports
DB_PB11 (out), DB_PB12 (out), DB_PD12 (out), DB_PD13 (out), DB_PD15 (out), SHIELD (in), SHIELD_CT (in), TS1 (out), TS2 (out), TS_CT (in)

### Nets
GND: C24.1 C52.1
TS_SHIELD: R103.2
NetC24_2: C24.2 R137.2
NetC52_2: C52.2 SB8.2 ; port TS_CT
NetCN6_51: SB11.1 ; port DB_PB11
NetCN6_52: SB9.1 ; port DB_PB12
NetCN7_2: SB7.1 ; port DB_PD15
NetCN7_4: SB6.1 ; port DB_PD13
NetCN7_6: SB8.1 ; port DB_PD12
NetR36_2: R137.1 SB11.2 ; port SHIELD_CT
NetR38_2: R103.1 SB9.2 ; port SHIELD
NetR42_1: R104.1 SB6.2 ; port TS1
NetR44_1: R122.2 ; port TS2
NetR102_1: R102.1 R122.1 SB7.2
NetR102_2: R102.2 TS1.1
NetR104_2: R104.2 TS2.1

### Notes on the sheet
- (near C52) PD12
- PD13
- PD15
- <----Active shield
- (near SB9) PB12
- PB11
- <----ESD resistor close to MCU pad
- <----Touch Sensing diameter 10mm min on active shield diameter 12mm min
- STM32303E-EVAL Touch Sensing
- MB1019
- 13
- STMicroelectronics
- Title:
- Number:
- Rev:
- Date:
- Sheet       of

### Library data of the parts
C24 = CAP: Capacitor
C52 = CAP: Capacitor; Value: 100pF; Published: 8-Jun-2000; Revision: July-2002: Re-released for DXP Platform.; Publisher: Altium Limited
R102-R104 R122 R137 = Res1: Resistor; Value: 1K; Published: 8-Jun-2000; Revision: July-2002: Re-released for DXP Platform.; Publisher: Altium Limited
SB6-SB9 SB11 = Circuit Breaker: Published: 24-Mar-1999; Revision: July-2002: Re-released for DXP Platform.; Publisher: Altium Limited

## Sheet Peripherals.SchDoc
size A4; Revision: C.2
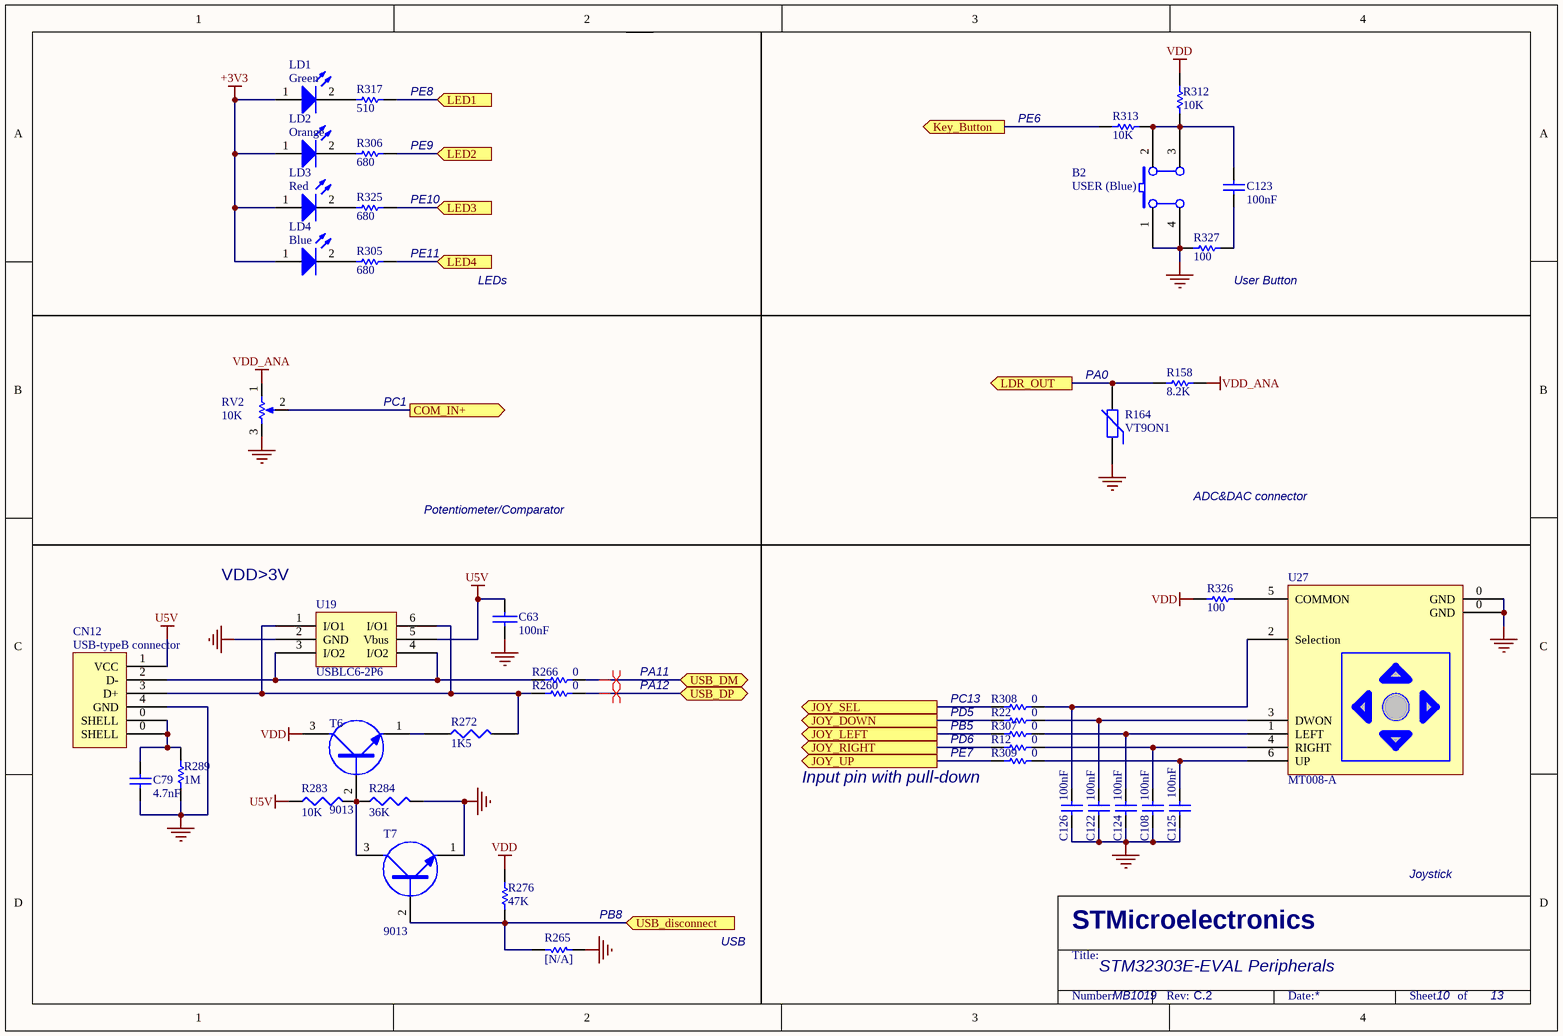
[diagram p5: Peripherals.SchDoc]

### Parts
B2  USER (Blue)  [PB10]
C63  100nF  [0603C]
C79  4.7nF  [0603C]
C108  100nF  [0603C]
C122  100nF  [0603C]
C123  100nF  [0603C]
C124  100nF  [0603C]
C125  100nF  [0603C]
C126  100nF  [0603C]
CN12  USB-typeB connector  [USB-B]
LD1  Green  [0603D]
LD2  Orange  [0603D]
LD3  Red  [0603D]
LD4  Blue  [0603D]
R12  0  [0603R]
R22  0  [0603R]
R158  8.2K  [0603R]
R164  VT9ON1  [PVT901]
R260  0  [0603R]
R265  [N/A]  [0603R]
R266  0  [0603R]
R272  1K5  [0603R]
R276  47K  [0603R]
R283  10K  [0603R]
R284  36K  [0603R]
R289  1M  [0603R]
R305  680  [0603R]
R306  680  [0603R]
R307  0  [0603R]
R308  0  [0603R]
R309  0  [0603R]
R312  10K  [0603R]
R313  10K  [0603R]
R317  510  [0603R]
R325  680  [0603R]
R326  100  [0603R]
R327  100  [0603R]
RV2  10K  [3296W]
T6  9013  [SOT-23]
T7  9013  [SOT-23]
U19  USBLC6-2P6  [SOT-666]
U27  MT008-A  [JOY]

### Ports
COM_IN+ (out), JOY_DOWN (out), JOY_LEFT (out), JOY_RIGHT (out), JOY_SEL (out), JOY_UP (out), Key_Button (out), LDR_OUT (out), LED1 (in), LED2 (in), LED3 (in), LED4 (in), USB_disconnect (in), USB_DM (bidir), USB_DP (bidir)

### Nets
+3V3: LD1.1(A) LD2.1(A) LD3.1(A) LD4.1(A)
GND: B2.1(A0) B2.4(A1) C63.2 C79.1 C108.1 C122.1 C124.1 C125.1 C126.1 CN12.4(GND) R164.1 R265.1 R284.2 R289.1 R327.1 RV2.3(TOP) T7.1(E) U19.2(GND) U27.0(GND)
U5V: C63.1 CN12.1(VCC) R283.1 U19.5(Vbus)
VDD: R276.2 R312.2 R326.1 T6.3(C)
VDD_ANA: R158.2 RV2.1(BOT)
PA11: R266.1 ; port USB_DM
PA12: R260.1 ; port USB_DP
PB5: R307.2 ; port JOY_LEFT
PC13: R308.2 ; port JOY_SEL
PD5: R22.1 ; port JOY_DOWN
PD6: R12.1 ; port JOY_RIGHT
PE7: R309.2 ; port JOY_UP
NetB2_2: B2.2(B0) B2.3(B1) C123.2 R312.1 R313.1
NetC79_2: C79.2 CN12.0(SHELL) R289.2
NetC108_2: C108.2 R12.2 U27.4(RIGHT)
NetC122_2: C122.2 R22.2 U27.3(DWON)
NetC123_1: C123.1 R327.2
NetC124_2: C124.2 R307.1 U27.1(LEFT)
NetC125_2: C125.2 R309.1 U27.6(UP)
NetC126_2: C126.2 R308.1 U27.2(Selection)
NetCN12_2: CN12.2(D-) R266.2 U19.3(I/O2) U19.4(I/O2)
NetCN12_3: CN12.3(D+) R260.2 R272.2 U19.1(I/O1) U19.6(I/O1)
NetLD1_2: LD1.2(K) R317.2
NetLD2_2: LD2.2(K) R306.2
NetLD3_2: LD3.2(K) R325.2
NetLD4_2: LD4.2(K) R305.2
NetR10_2: R158.1 R164.2 ; port LDR_OUT
NetR14_1: RV2.2(TAP) ; port COM_IN+
NetR18_2: R265.2 R276.1 T7.2(B) ; port USB_disconnect
NetR24_1: R317.1 ; port LED1
NetR26_1: R306.1 ; port LED2
NetR28_1: R325.1 ; port LED3
NetR30_1: R305.1 ; port LED4
NetR111_1: R313.2 ; port Key_Button
NetR272_1: R272.1 T6.1(E)
NetR283_2: R283.2 R284.1 T6.2(B) T7.3(C)
NetR326_2: R326.2 U27.5(COMMON)

### Layout directives
differential pair: PA11, PA12

### Notes on the sheet
- (near R317) PE8
- (near R306) PE9
- PE6
- (near R325) PE10
- (near R305) PE11
- LEDs
- (near R327) User Button
- (near R164) PA0
- PC1
- Potentiometer/Comparator
- ADC&DAC connector
- VDD>3V
- PA12
- PA11
- PD5
- PC13
- (near R309) Input pin with pull-down
- PE7
- PD6
- PB5
- (near R265) PB8
- Joystick
- USB
- STM32303E-EVAL Peripherals
- MB1019
- 10
- 13
- STMicroelectronics
- Title:
- Number:
- Rev:
- Date:
- Sheet       of

### Library data of the parts
B2 = SW PUSHBUTTON: SE PUSHBUTTON
C63 = CAP: Capacitor
C79 C108 C122-C126 = CAP: Capacitor; Value: 100pF; Published: 8-Jun-2000; Revision: July-2002: Re-released for DXP Platform.; Publisher: Altium Limited
CN12 = USB-B
LD1-LD4 = LED2: Typical RED, GREEN, YELLOW, AMBER GaAs LED; Published: 8-Jun-2000; Revision: July-2002: Re-released for DXP Platform.; Publisher: Altium Limited
R12 R22 R158 R260 R265 R266 R276 R289 R305-R309 R313 R317 R325-R327 = Res1: Resistor; Value: 1K; Published: 8-Jun-2000; Revision: July-2002: Re-released for DXP Platform.; Publisher: Altium Limited
R164 = Res Varistor: Varistor (Voltage-Sensitive Resistor); Published: 24-Mar-1999; Revision: July-2002: Re-released for DXP Platform.; Publisher: Altium Limited
R272 = RES1
R283 R284 = R: Right: 20; Bottom: 30
R312 = res1: Resistor; Value: 1K; Published: 8-Jun-2000; Revision: July-2002: Re-released for DXP Platform.; Publisher: Altium Limited
RV2 = RV
T6 T7 = NPN
U19 = USBLC6-2
U27 = MT-008A